# EAGLE design Board_v.02b (EAGLE 6.5.0)
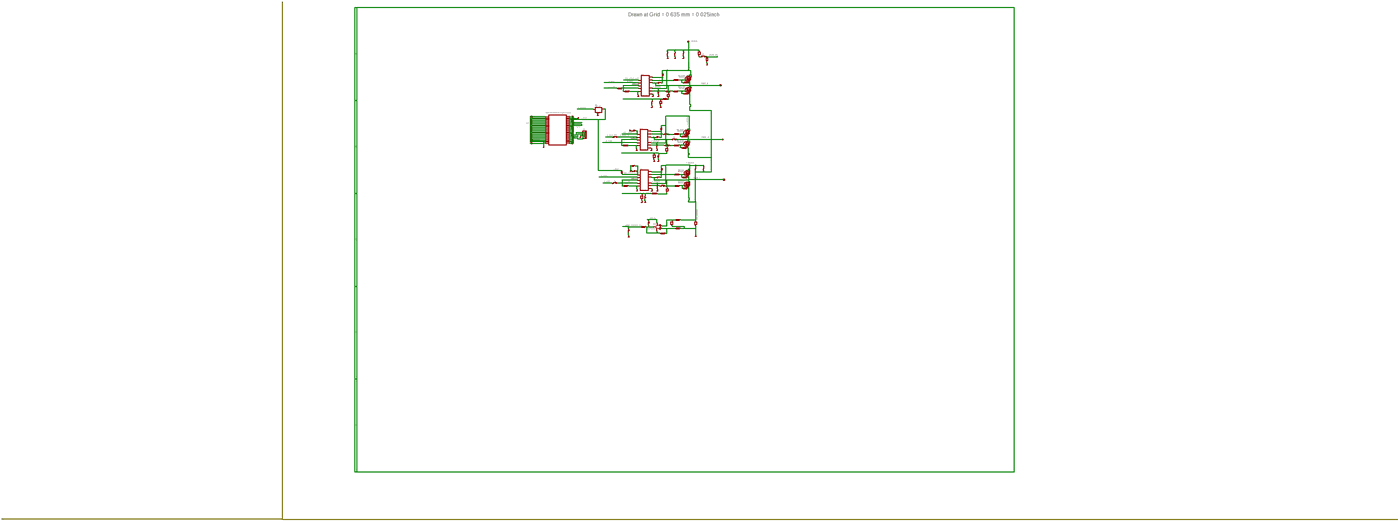
[diagram p0: schematic, sheet 1, overview]
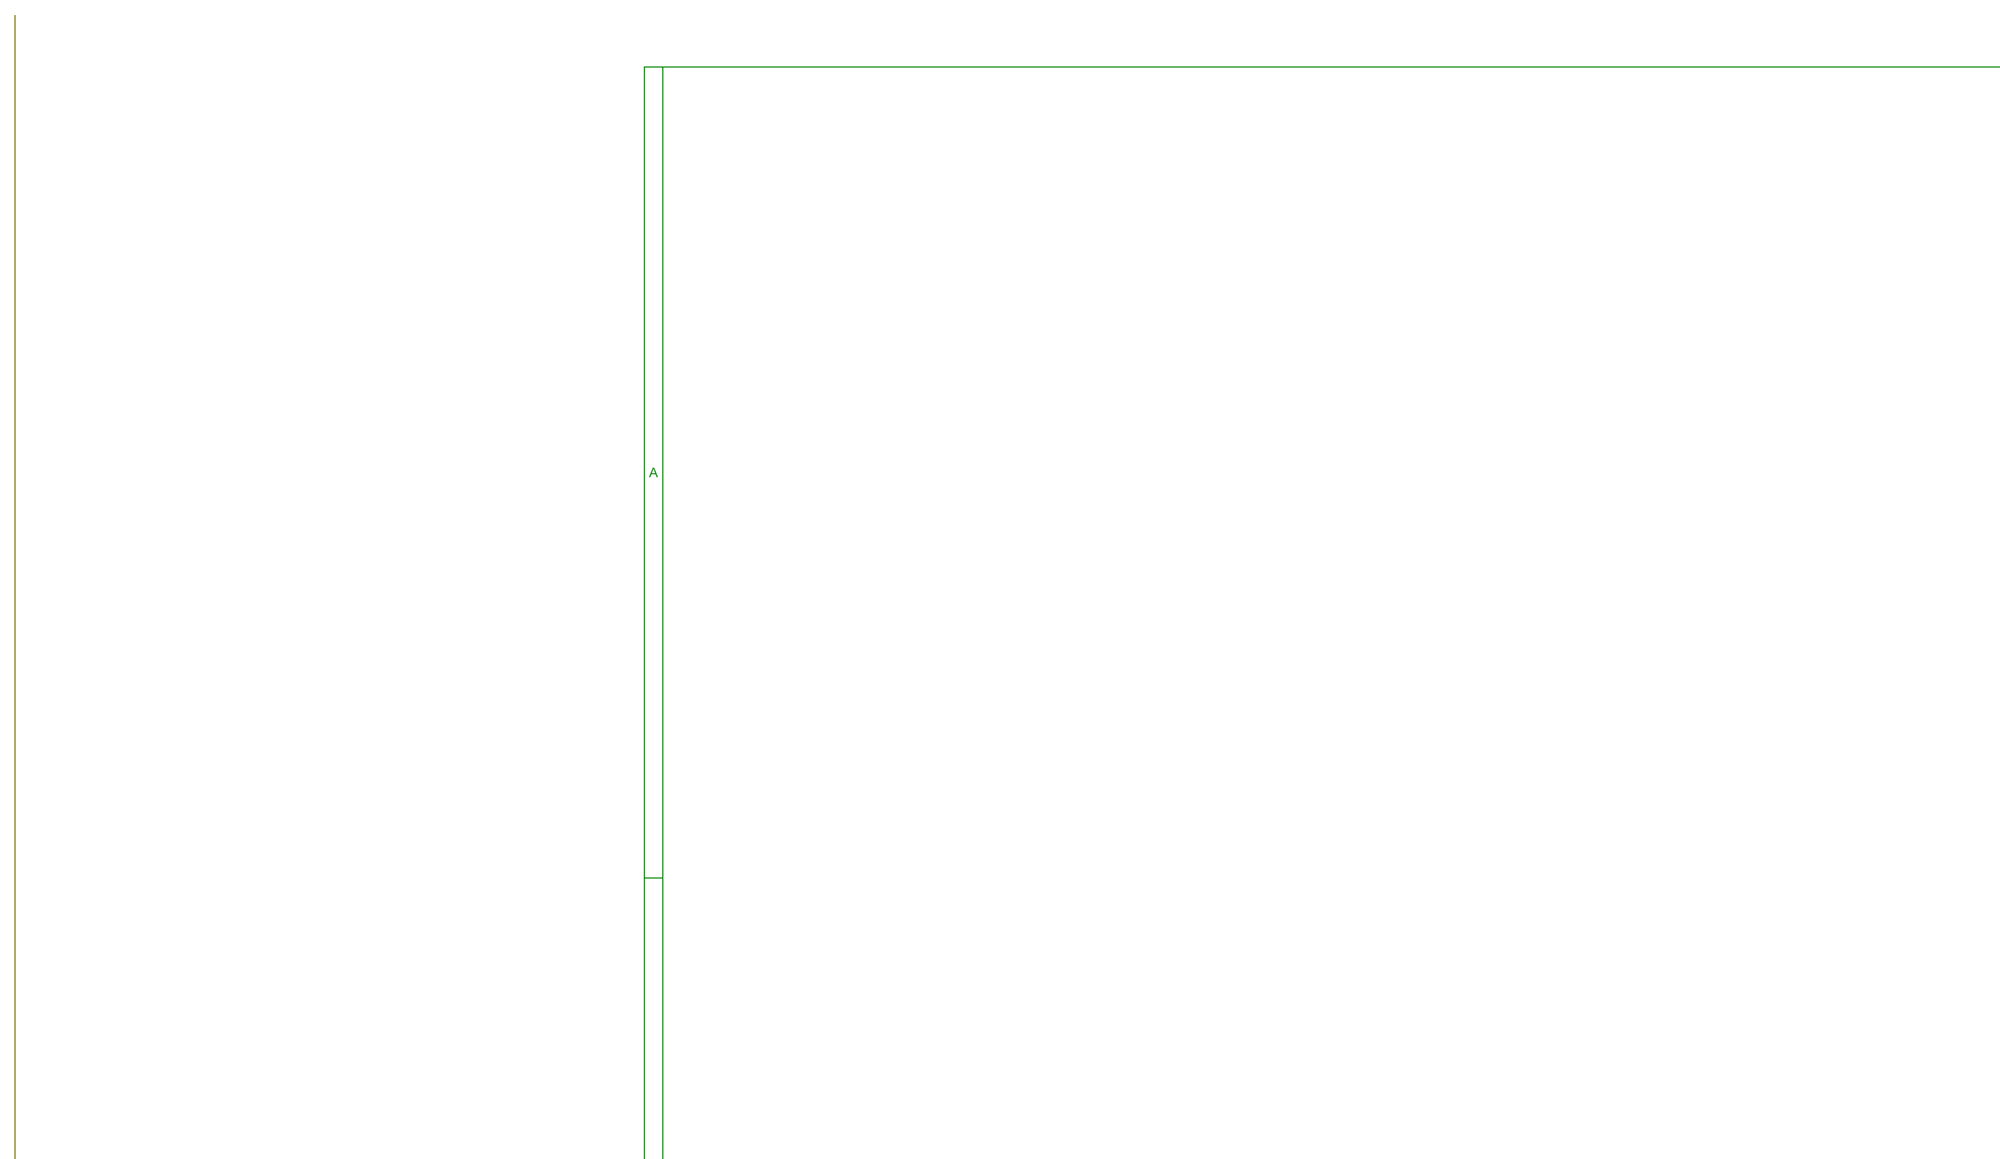
[diagram p1: schematic, sheet 1, part 1 of 7]
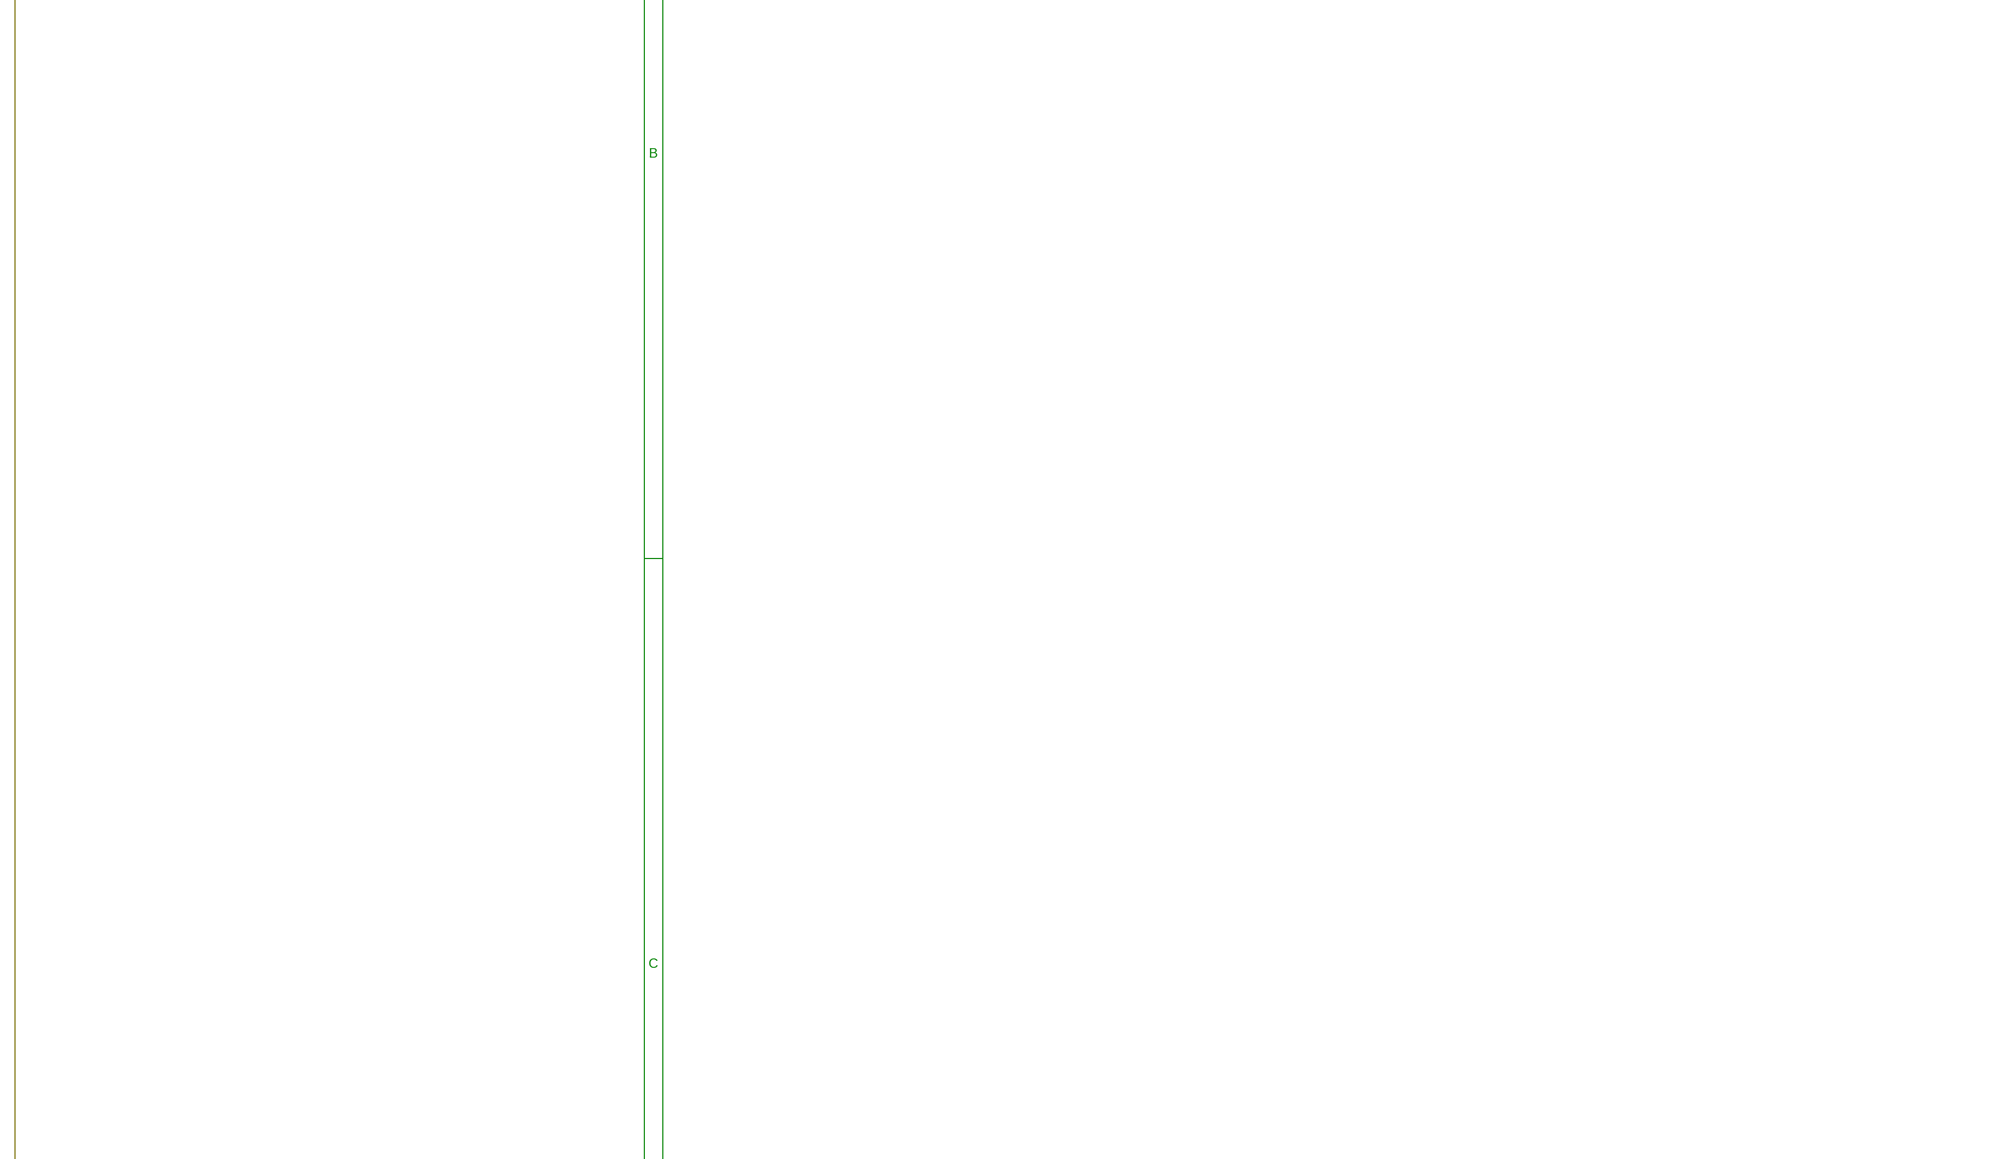
[diagram p2: schematic, sheet 1, part 2 of 7]
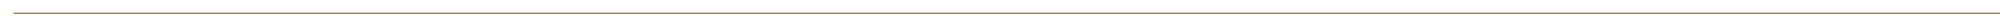
[diagram p3: schematic, sheet 1, part 3 of 7]
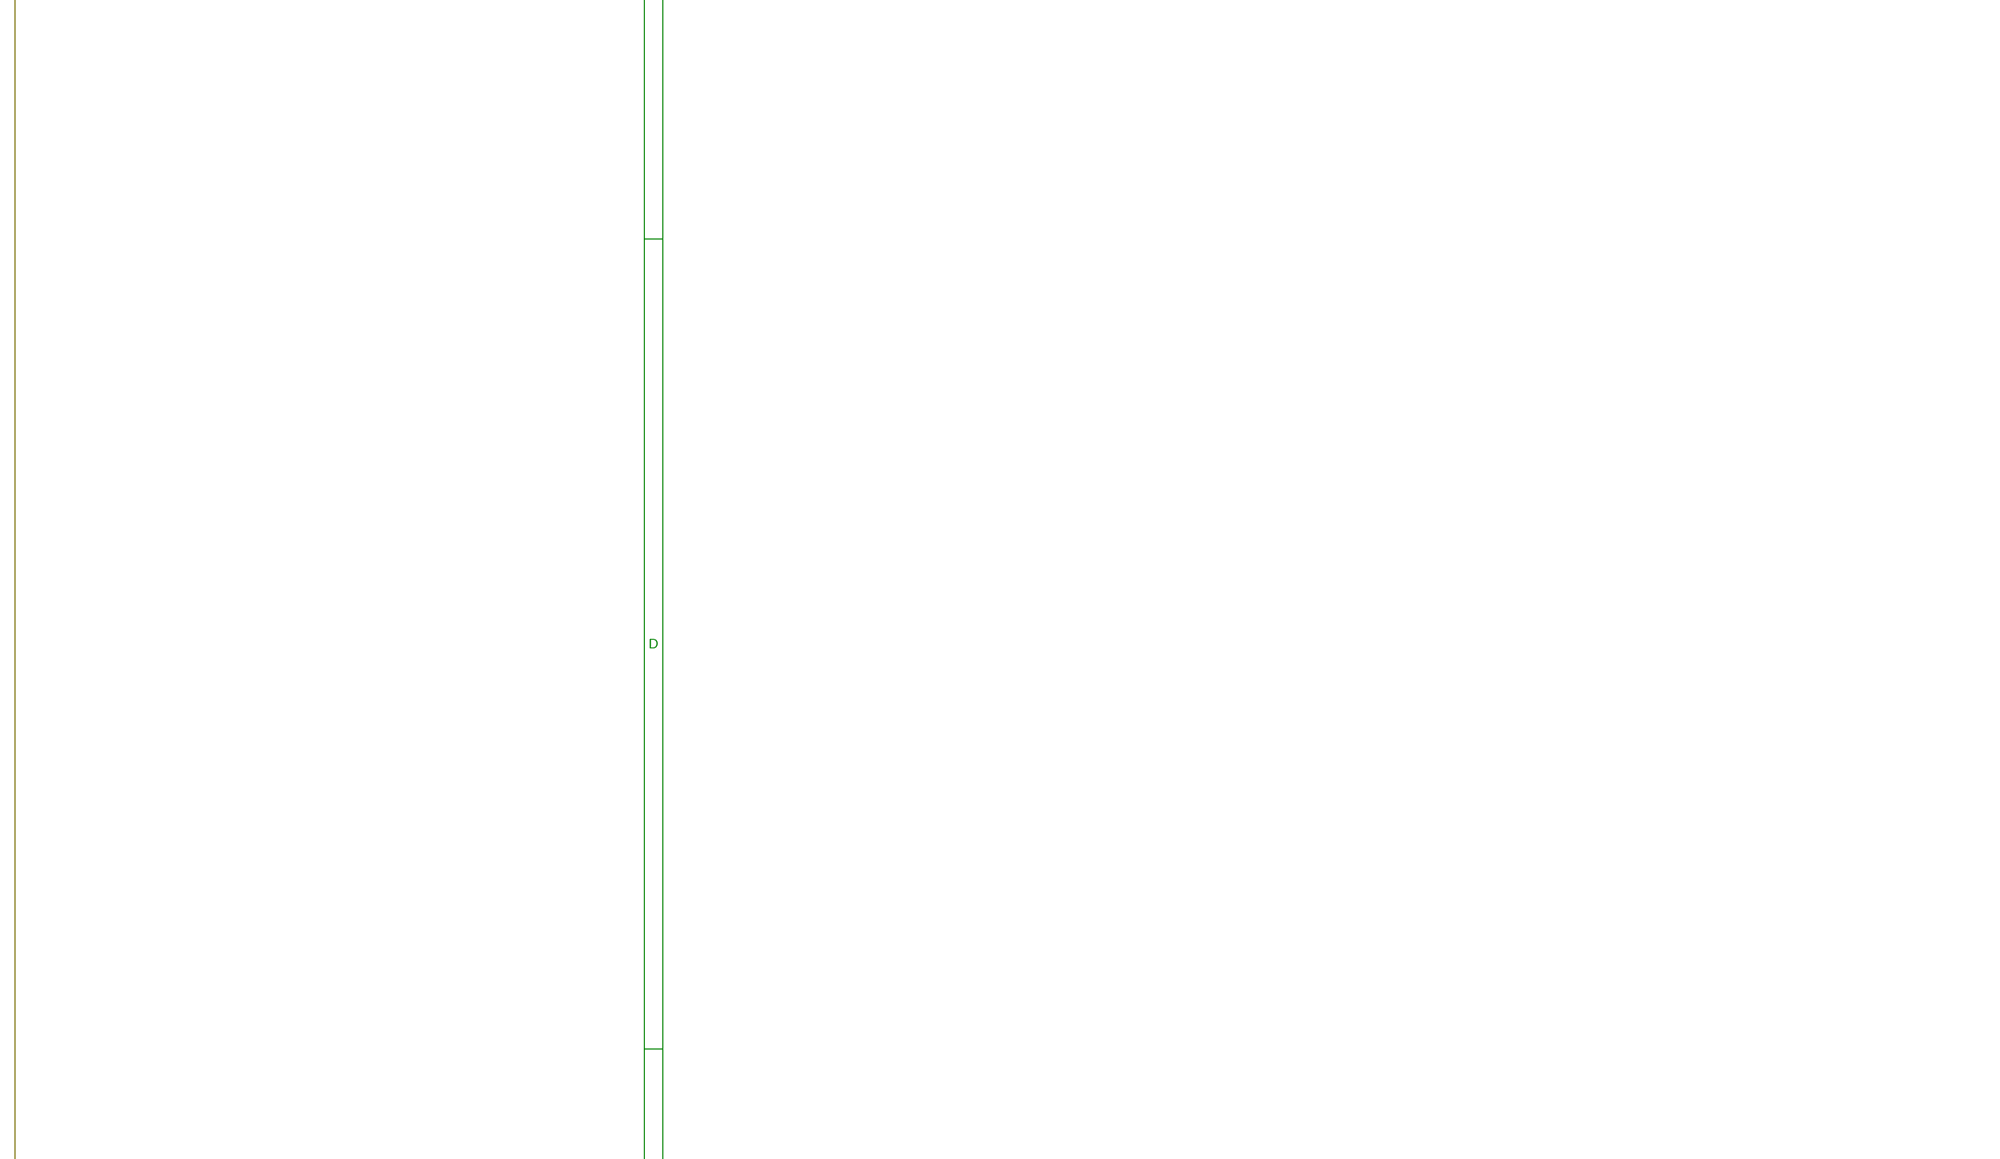
[diagram p4: schematic, sheet 1, part 4 of 7]
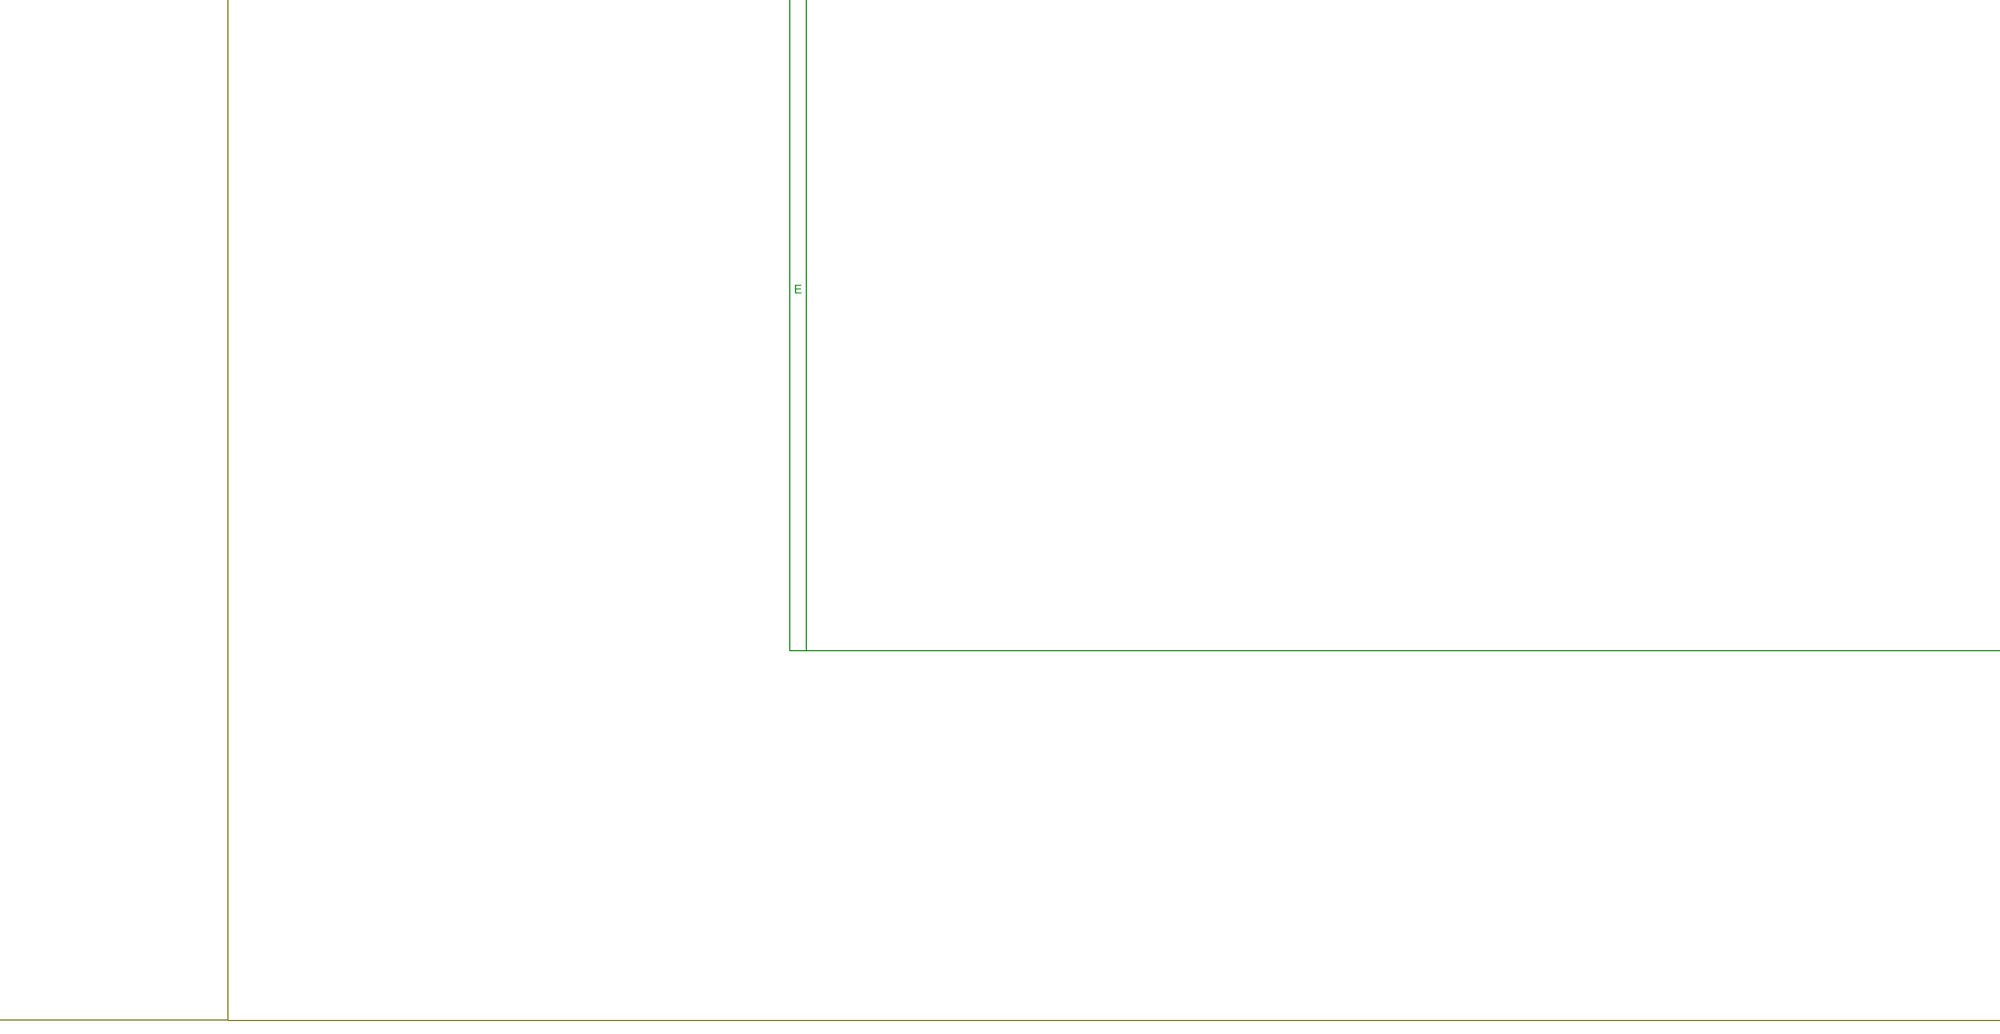
[diagram p5: schematic, sheet 1, part 5 of 7]
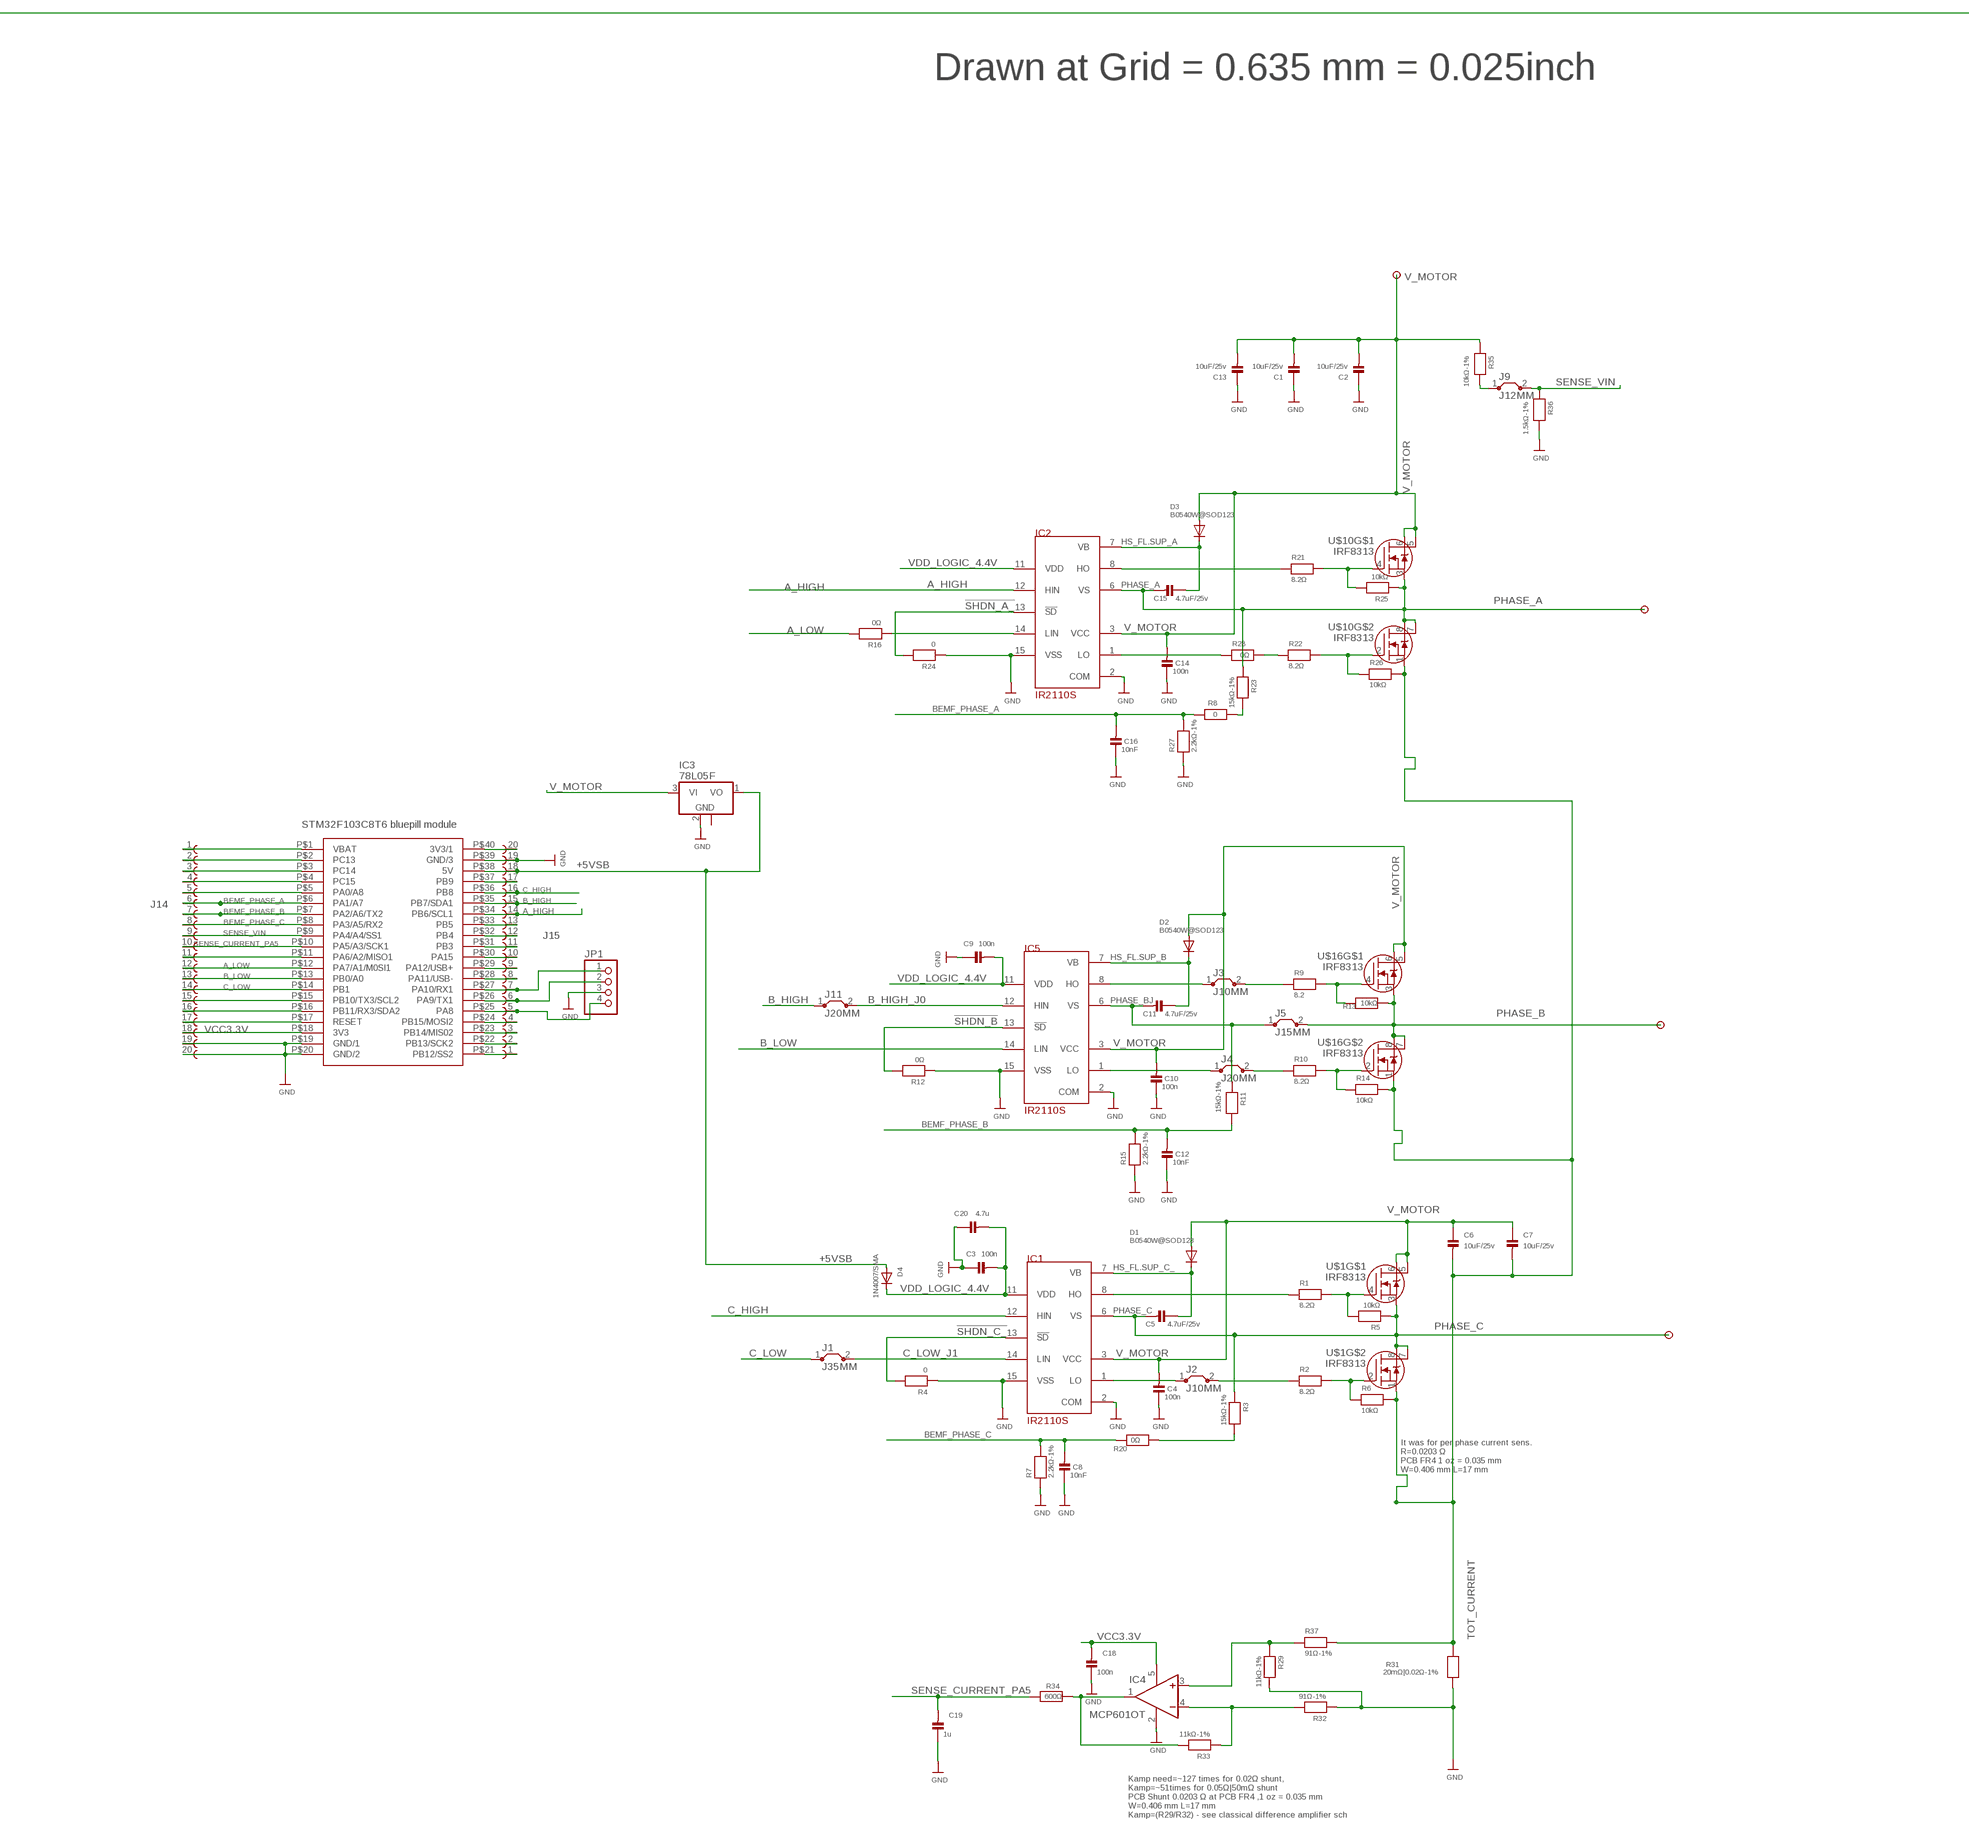
[diagram p6: schematic, sheet 1, part 6 of 7]
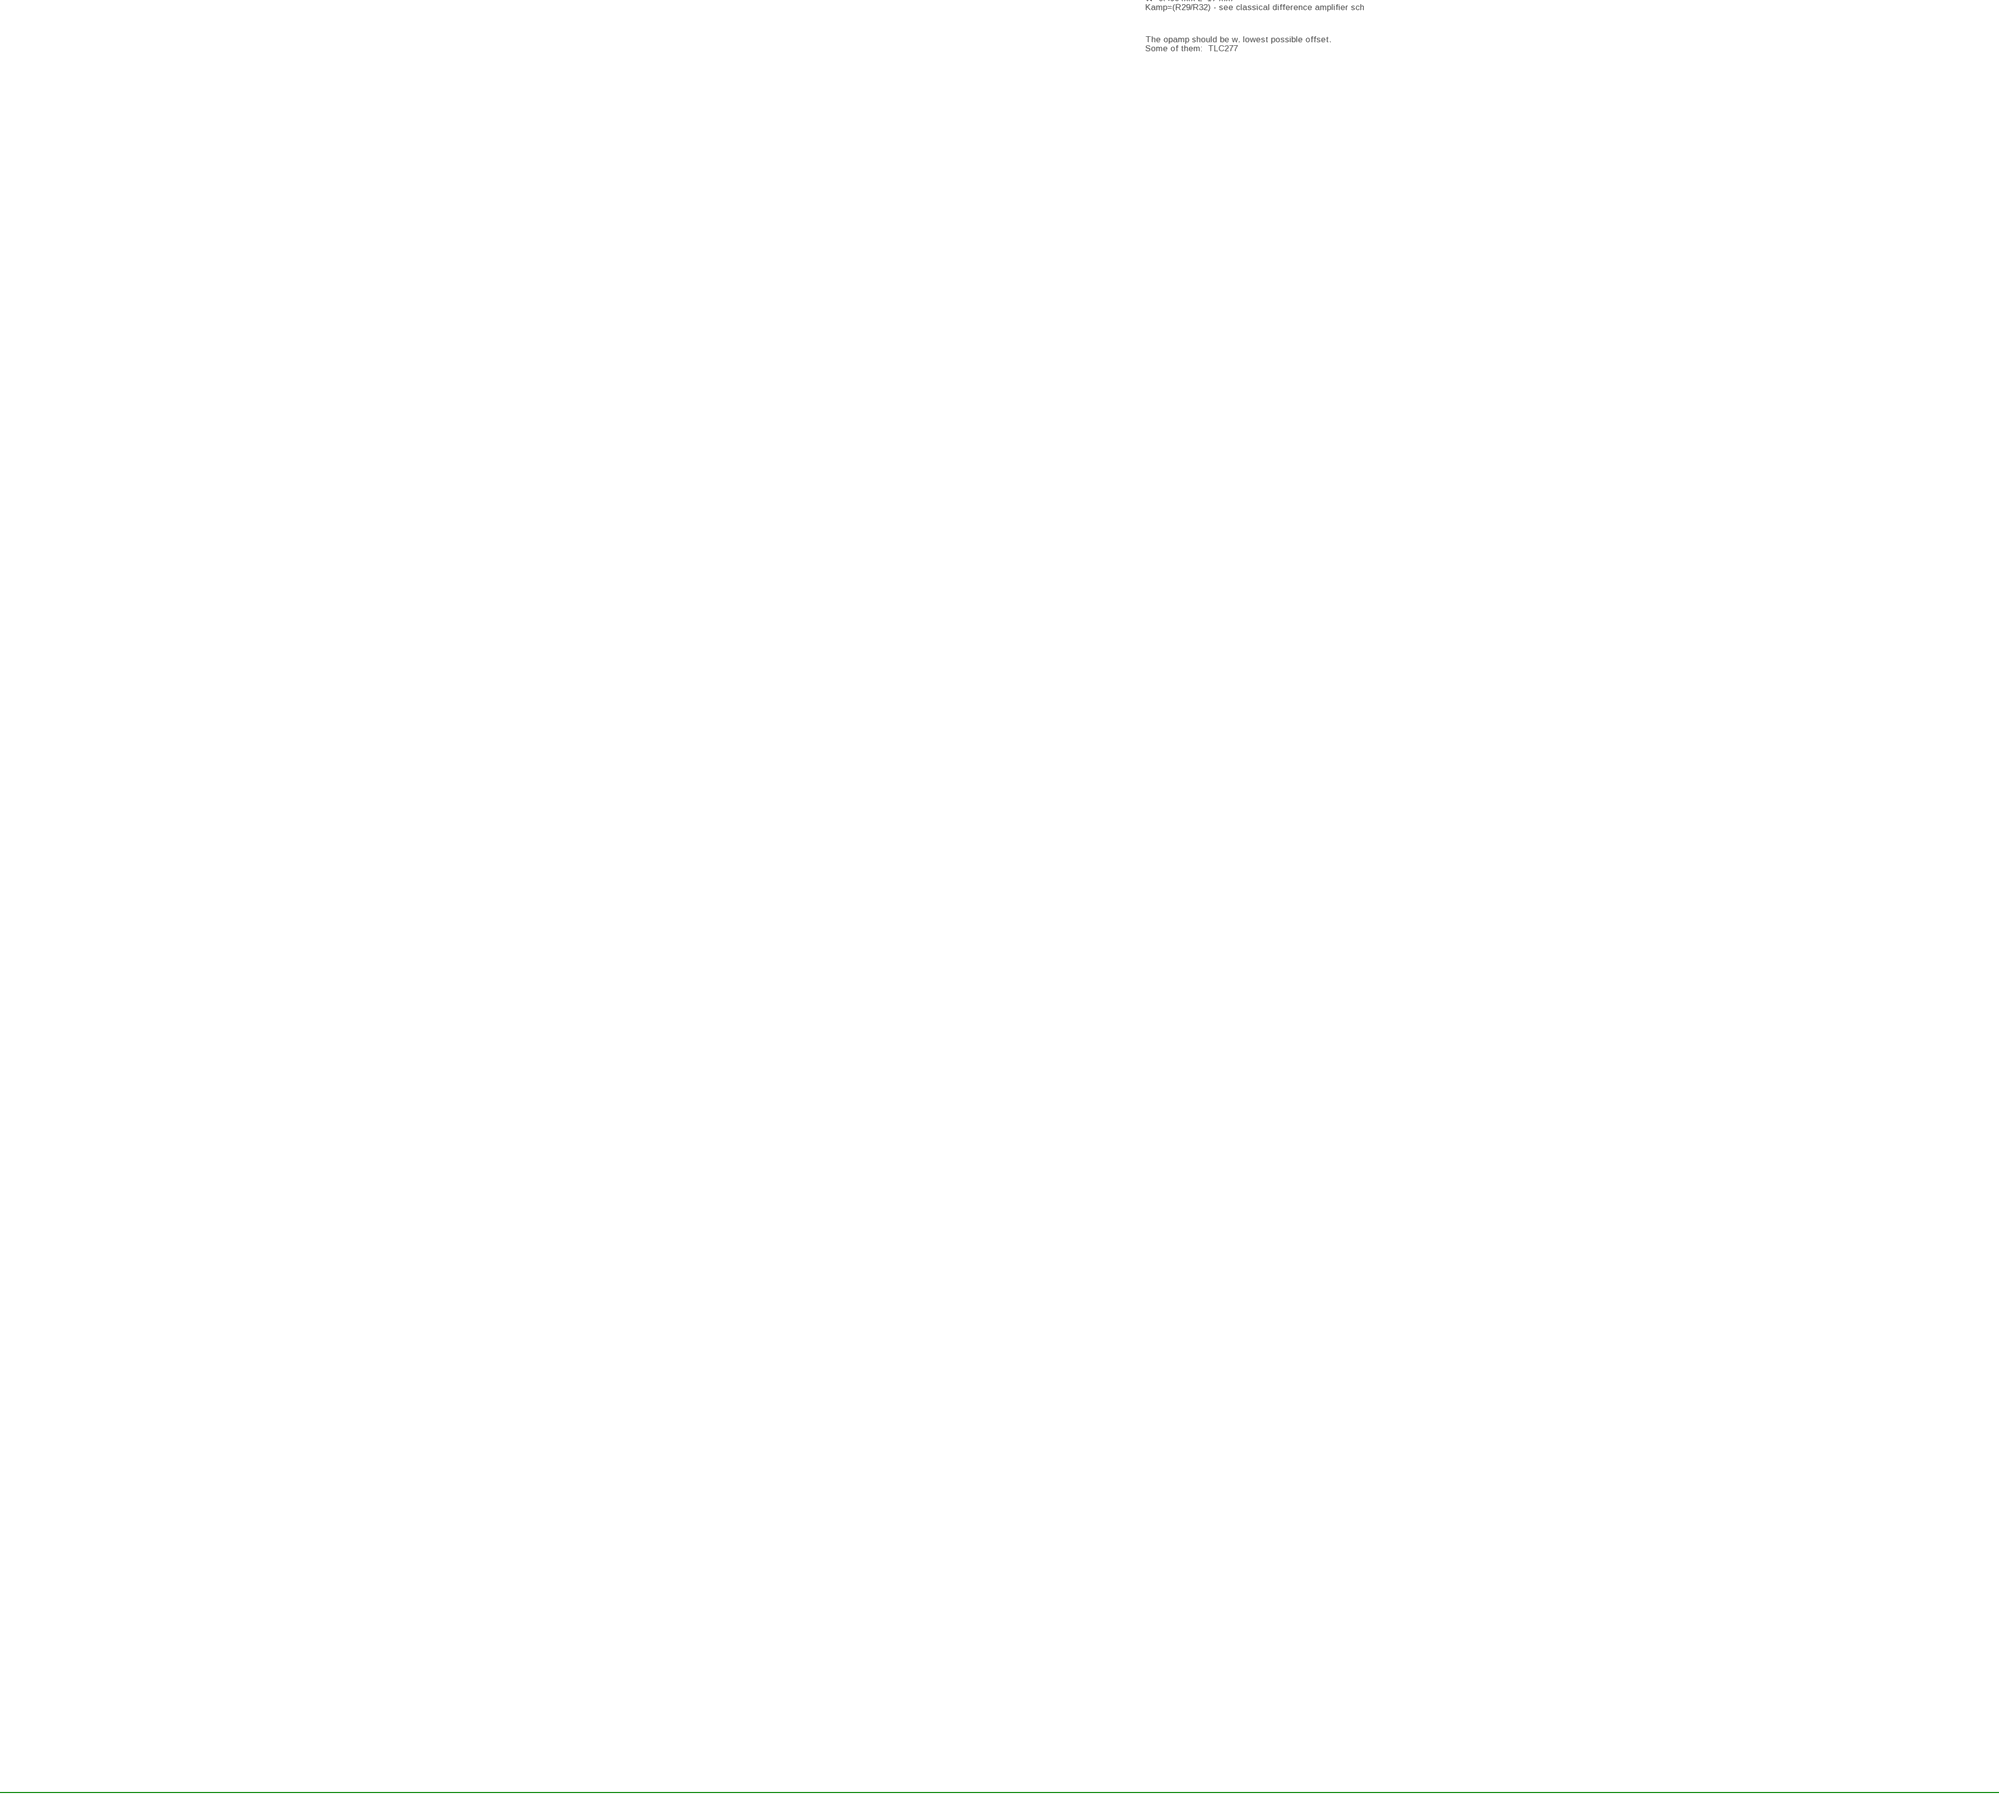
[diagram p7: schematic, sheet 1, part 7 of 7]

## Parts
BLUEPILL-STM32F103C8T6_MODULE  BLUEPILL  [40-DIP-BLUE-PIL]
C1  10uF/25v  CAP_CERAMIC_0805MP  [_0805MP]
C2  10uF/25v  CAP_CERAMIC_0805MP  [_0805MP]
C3  100n  CAP_CERAMIC_0805MP  [_0805MP]
C4  100n  CAP_CERAMIC_0603MP  [_0603MP]
C5  4.7uF/25v  CAP_CERAMIC_0805MP  [_0805MP]
C6  10uF/25v  CAP_CERAMIC_0805MP  [_0805MP]
C7  10uF/25v  CAP_CERAMIC_0805MP  [_0805MP]
C8  10nF  CAP_CERAMIC_0805MP  [_0805MP]
C9  100n  CAP_CERAMIC_0603MP  [_0603MP]
C10  100n  CAP_CERAMIC_0603MP  [_0603MP]
C11  4.7uF/25v  CAP_CERAMIC_0805MP  [_0805MP]
C12  10nF  CAP_CERAMIC_0805MP  [_0805MP]
C13  10uF/25v  CAP_CERAMIC_0805MP  [_0805MP]
C14  100n  CAP_CERAMIC_0603MP  [_0603MP]
C15  4.7uF/25v  CAP_CERAMIC_0805MP  [_0805MP]
C16  10nF  CAP_CERAMIC_0805MP  [_0805MP]
C18  100n  CAP_CERAMIC_0805MP  [_0805MP]
C19  1u  CAP_CERAMIC_0805MP  [_0805MP]
C20  4.7u  CAP_CERAMIC_0805MP  [_0805MP]
D1  B0540W@SOD123  DIODESOD-123  [SOD-123]
D2  B0540W@SOD123  DIODESOD-123  [SOD-123]
D3  B0540W@SOD123  DIODESOD-123  [SOD-123]
D4  1N4007/SMA  DIODESMA  [SMADIODE]
IC1  IR2110S  [SO-16DW]
IC2  IR2110S  [SO-16DW]
IC3  78L05F  [SOT89]
IC4  MCP601OT  [SOT23-5]
IC5  IR2110S  [SO-16DW]
J1  J35MM  [J35MM]
J2  J10MM  [10]
J3  J10MM  [10]
J4  J20MM  [20]
J5  J15MM  [15]
J9  J12MM  [12]
J11  J20MM  [20]
J14  61002013321  [CON-20PIN-SMD-MANUALLY-BENT-FROM-NON-SMD]
J15  61002013321  [CON-20PIN-SMD-MANUALLY-BENT-FROM-NON-SMD]
JP1  PINHD-1X04_2.54-SMD  [1X04SMD]
PHASE_A  PHASE_A  PAD  [PAD]
PHASE_B  PHASE_B  PAD  [PAD]
PHASE_C  PHASE_C  PAD  [PAD]
R1  8.2Ω  RESISTOR_0805MP  [_0805MP]
R2  8.2Ω  RESISTOR_0805MP  [_0805MP]
R3  15kΩ-1%  RESISTOR_0805MP  [_0805MP]
R4  0  RESISTOR_0805MP  [_0805MP]
R5  10kΩ  RESISTOR_0805MP  [_0805MP]
R6  10kΩ  RESISTOR_0805MP  [_0805MP]
R7  2.2kΩ-1%  RESISTOR_0805MP  [_0805MP]
R8  0  RESISTOR_0805MP  [_0805MP]
R9  8.2  RESISTOR_0805MP  [_0805MP]
R10  8.2Ω  RESISTOR_0805MP  [_0805MP]
R11  15kΩ-1%  RESISTOR_0805MP  [_0805MP]
R12  0Ω  RESISTOR_0805MP  [_0805MP]
R13  10kΩ  RESISTOR_0805MP  [_0805MP]
R14  10kΩ  RESISTOR_0805MP  [_0805MP]
R15  2.2kΩ-1%  RESISTOR_0805MP  [_0805MP]
R16  0Ω  RESISTOR_0805MP  [_0805MP]
R20  0Ω  RESISTOR_0805MP  [_0805MP]
R21  8.2Ω  RESISTOR_0805MP  [_0805MP]
R22  8.2Ω  RESISTOR_0805MP  [_0805MP]
R23  15kΩ-1%  RESISTOR_0805MP  [_0805MP]
R24  0  RESISTOR_0805MP  [_0805MP]
R25  10kΩ  RESISTOR_0805MP  [_0805MP]
R26  10kΩ  RESISTOR_0805MP  [_0805MP]
R27  2.2kΩ-1%  RESISTOR_0805MP  [_0805MP]
R28  0Ω  RESISTOR_0805MP  [_0805MP]
R29  11kΩ-1%  RESISTOR_0805MP  [_0805MP]
R31  20mΩ|0.02Ω-1%  RESISTOR2512  [2512]
R32  91Ω-1%  RESISTOR_0805MP  [_0805MP]
R33  11kΩ-1%  RESISTOR_0805MP  [_0805MP]
R34  600Ω  RESISTOR_0805MP  [_0805MP]
R35  10kΩ-1%  RESISTOR_0805MP  [_0805MP]
R36  1.5kΩ-1%  RESISTOR_0805MP  [_0805MP]
R37  91Ω-1%  RESISTOR_0805MP  [_0805MP]
U$1  IRF8313  [SO08]
U$10  IRF8313  [SO08]
U$16  IRF8313  [SO08]
V_MOTOR  V_MOTOR  PAD  [PAD]

## Nets
!SHDN_A_: IC2.13(!SD) R24.2
!SHDN_B: IC5.13(!SD) R12.2
!SHDN_C_: IC1.13(!SD) R4.2
+5VSB: BLUEPILL-STM32F103C8T6_MODULE.P$38(5V) D4.A IC3.1(VO) J15.18
A_HIGH: BLUEPILL-STM32F103C8T6_MODULE.P$34(PB6/SCL1) IC2.12(HIN) J15.14
A_LOW: BLUEPILL-STM32F103C8T6_MODULE.P$12(PA7/A1/M0SI1) J14.12 R16.2
B_HIGH: BLUEPILL-STM32F103C8T6_MODULE.P$35(PB7/SDA1) J11.1 J15.15
B_HIGH_J0: IC5.12(HIN) J11.2
B_LOW: BLUEPILL-STM32F103C8T6_MODULE.P$13(PB0/A0) IC5.14(LIN) J14.13
BEMF_PHASE_A: BLUEPILL-STM32F103C8T6_MODULE.P$6(PA1/A7) C16.2 J14.6 R8.1 R27.2
BEMF_PHASE_B: BLUEPILL-STM32F103C8T6_MODULE.P$7(PA2/A6/TX2) C12.2 J14.7 R11.2 R15.2
BEMF_PHASE_C: BLUEPILL-STM32F103C8T6_MODULE.P$8(PA3/A5/RX2) C8.2 J14.8 R7.2 R20.2
C_HIGH: BLUEPILL-STM32F103C8T6_MODULE.P$36(PB8) IC1.12(HIN) J15.16
C_LOW: BLUEPILL-STM32F103C8T6_MODULE.P$14(PB1) J1.1 J14.14
C_LOW_J1: IC1.14(LIN) J1.2
GND: BLUEPILL-STM32F103C8T6_MODULE.P$19(GND/1) BLUEPILL-STM32F103C8T6_MODULE.P$20(GND/2) BLUEPILL-STM32F103C8T6_MODULE.P$39(GND/3) C1.1 C2.1 C3.1 C4.1 C8.1 C9.1 C10.1 C12.1 C13.1 C14.1 C16.1 C18.1 C19.1 C20.1 IC1.2(COM) IC1.15(VSS) IC2.2(COM) IC2.15(VSS) IC3.2(GND) IC4.2(V-) IC5.2(COM) IC5.15(VSS) J14.19 J14.20 J15.19 JP1.3 R4.1 R7.1 R12.1 R15.1 R24.1 R27.1 R29.2 R31.2 R32.1 R36.2
HS_FL.SUP_A: C15.1 D3.C IC2.7(VB)
HS_FL.SUP_B: C11.1 D2.C IC5.7(VB)
HS_FL.SUP_C_: C5.1 D1.C IC1.7(VB)
N$1: R1.2 R5.2 U$1.4(G)
N$2: J3.2 R9.1
N$3: R2.2 R6.1 U$1.2(G)
N$4: IC1.8(HO) R1.1
N$5: J2.2 R2.1
N$6: IC1.1(LO) J2.1
N$7: R8.2 R23.2
N$8: R3.2 R20.1
N$9: R9.2 R13.2 U$16.4(G)
N$10: IC5.8(HO) J3.1
N$11: R10.2 R14.1 U$16.2(G)
N$12: J4.2 R10.1
N$13: IC5.1(LO) J4.1
N$14: IC4.4(-IN) R32.2 R33.1
N$17: R21.2 R25.2 U$10.4(G)
N$18: R22.2 R26.1 U$10.2(G)
N$19: IC2.8(HO) R21.1
N$20: R22.1 R28.2
N$23: IC2.1(LO) R28.1
N$24: IC4.1(OUT) R33.2 R34.1
N$25: BLUEPILL-STM32F103C8T6_MODULE.P$5(PA0/A8) J14.5
N$26: IC2.14(LIN) R16.1
N$27: J9.1 R35.2
N$30: BLUEPILL-STM32F103C8T6_MODULE.P$26(PA9/TX1) J15.6 JP1.2
N$31: BLUEPILL-STM32F103C8T6_MODULE.P$27(PA10/RX1) J15.7 JP1.1
N$32: IC4.3(+IN) R29.1 R37.1
N$34: BLUEPILL-STM32F103C8T6_MODULE.P$1(VBAT) J14.1
N$35: BLUEPILL-STM32F103C8T6_MODULE.P$2(PC13) J14.2
N$36: BLUEPILL-STM32F103C8T6_MODULE.P$3(PC14) J14.3
N$37: BLUEPILL-STM32F103C8T6_MODULE.P$4(PC15) J14.4
N$38: BLUEPILL-STM32F103C8T6_MODULE.P$11(PA6/A2/MISO1) J14.11
N$39: BLUEPILL-STM32F103C8T6_MODULE.P$15(PB10/TX3/SCL2) J14.15
N$40: BLUEPILL-STM32F103C8T6_MODULE.P$16(PB11/RX3/SDA2) J14.16
N$41: BLUEPILL-STM32F103C8T6_MODULE.P$17(RESET) J14.17
N$43: BLUEPILL-STM32F103C8T6_MODULE.P$21(PB12/SS2) J15.1
N$44: BLUEPILL-STM32F103C8T6_MODULE.P$22(PB13/SCK2) J15.2
N$45: BLUEPILL-STM32F103C8T6_MODULE.P$23(PB14/MIS02) J15.3
N$46: BLUEPILL-STM32F103C8T6_MODULE.P$24(PB15/MOSI2) J15.4
N$47: BLUEPILL-STM32F103C8T6_MODULE.P$25(PA8) J15.5 JP1.4
N$48: BLUEPILL-STM32F103C8T6_MODULE.P$28(PA11/USB-) J15.8
N$49: BLUEPILL-STM32F103C8T6_MODULE.P$29(PA12/USB+) J15.9
N$50: BLUEPILL-STM32F103C8T6_MODULE.P$30(PA15) J15.10
N$51: BLUEPILL-STM32F103C8T6_MODULE.P$31(PB3) J15.11
N$52: BLUEPILL-STM32F103C8T6_MODULE.P$32(PB4) J15.12
N$53: BLUEPILL-STM32F103C8T6_MODULE.P$33(PB5) J15.13
N$54: BLUEPILL-STM32F103C8T6_MODULE.P$37(PB9) J15.17
N$55: BLUEPILL-STM32F103C8T6_MODULE.P$40(3V3/1) J15.20
PHASE_A: C15.2 IC2.6(VS) PHASE_C.1 R23.1 R25.1 U$10.3(S) U$10.7(D) U$10.8(D)
PHASE_B: J5.2 PHASE_B.1 R13.1 U$16.3(S) U$16.7(D) U$16.8(D)
PHASE_BJ: C11.2 IC5.6(VS) J5.1 R11.1
PHASE_C: C5.2 IC1.6(VS) PHASE_A.1 R3.1 R5.1 U$1.3(S) U$1.7(D) U$1.8(D)
SENSE_CURRENT_PA5: BLUEPILL-STM32F103C8T6_MODULE.P$10(PA5/A3/SCK1) C19.2 J14.10 R34.2
SENSE_VIN: BLUEPILL-STM32F103C8T6_MODULE.P$9(PA4/A4/SS1) J9.2 J14.9 R36.1
TOT_CURRENT: C6.2 C7.2 R6.2 R14.2 R26.2 R31.1 R37.2 U$1.1(S) U$10.1(S) U$16.1(S)
V_MOTOR: C1.2 C2.2 C4.2 C6.1 C7.1 C10.2 C13.2 C14.2 D1.A D2.A D3.A IC1.3(VCC) IC2.3(VCC) IC3.3(VI) IC5.3(VCC) R35.1 U$1.5(D) U$1.6(D) U$10.5(D) U$10.6(D) U$16.5(D) U$16.6(D) V_MOTOR.1
VCC3.3V: BLUEPILL-STM32F103C8T6_MODULE.P$18(3V3) C18.2 IC4.5(V+) J14.18
VDD_LOGIC_4.4V: C3.2 C9.2 C20.2 D4.C IC1.11(VDD) IC2.11(VDD) IC5.11(VDD)
Unconnected: IC3.2@1(GND)

## Notes on the sheet
- Drawn at Grid = 0.635 mm = 0.025inch
- It was for per phase current sens.
  R=0.0203 Ω 
  PCB FR4 1 oz = 0.035 mm
  W=0.406 mm L=17 mm
- Kamp need=~127 times for 0.02Ω shunt, 
  Kamp=~51times for 0.05Ω|50mΩ shunt
  PCB Shunt 0.0203 Ω at PCB FR4 ,1 oz = 0.035 mm
  W=0.406 mm L=17 mm
  Kamp=(R29/R32) - see classical difference amplifier sch
- The opamp should be w. lowest possible offset. 
  Some of them:  TLC277

## Library data of the parts
BLUEPILL-STM32F103C8T6_MODULE = maplemini:BLUEPILL; NAME1: STM32F103C8T6 bluepill module
C1-C16 C18-C20 = microbuilder:CAP_CERAMIC: Ceramic Capacitors 0402 - 0402 Surface Mount Capacitors 16pF 50V 5% [Digikey: 445-4899-2-ND] 18pF 50V 5% [Digikey: 490-1281-2-ND] 22pF 50V 5% [Digikey: 490-1283-2-ND] 68pF 50V 5% [Digikey: 490-1289-2-ND] 0.1uF 10V 10% [Digikey: 490-1318-2-ND] 1.0uF 6.3V 10% [Digikey: 490-1320-2-ND] 0603 - 0603 Surface Mount Capacitors 16 pF 50V 5% [Digikey: 445-5051-2-ND] 22 pF 50V [Digikey: PCC220ACVTR-ND] 33 pF 50V 5% [Digikey: 490-1415-1-ND] 56pF 50V 5% [Digikey: 490-1421-1-ND] 220pF 50V 5% [Digikey: 445-1285-1-ND] 680 pF 50V 2200 pF 50V 5% C0G [Digikey: 445-1297-1-ND] 5600 pF 100V 5% X7R [Digikey: 478-3711-1-ND] 0.1 µF 25V 10% [Digikey: PCC2277TR-ND] 0.22 µF 16V 10% X7R [Digikey: 445-1318-1-ND] 1.0 µF 25V 10% [Digikey: 445-5146-2-ND] 0603 - RF Specific 3pF 250V +/-0.1pF RF [Digikey: 712-1347-1-ND] 18 pF 250V 5% [Digikey: 478-3505-1-ND or 712-1322-1-ND] 56 pF 250V 5% C0G RF [Digikey: 490-4867-1-ND] 68 pF 250V RF [Digikey: 490-4868-1-ND] 0805 - 0805 Surface Mount Capacitors 220 pF 250V 2% RF Ceramic Capacitor [Digikey: 712-1398-1-ND] 1000 pF 50V 2% NP0 Ceramic Capacitor [Digikey: 478-3760-1-ND] 0.1 µF 25V 10% Ceramic Capacitor [Digikey: PCC1828TR-ND] 1.0 µF 16V 10% Ceramic Capacitor[Digikey: 490-1691-2-ND] 10.0 µF 10V 10% Ceramic Capacitor[Digikey: 709-1228-1-ND] 10.0 uF 16V 10% Ceramic Capacitor [Digikey: 478-5165-2-ND] 47 uF 6.3V 20% Ceramic Capacitor [Digikey: 587-1779-1-ND or 399-5506-1-ND] 1206 - 1206 Surface Mount Capacitors 47uF 10V 20% Ceramic Capacitor [Digikey: 490-5528-1-ND or 399-5508-1-ND or 445-6010-1-ND] 100uF 6.3V -20%, +80% Y5V Ceramic Capacitor (Digikey: 490-4512-1-ND, Mouser: 81-GRM31CF50J107ZE1L)
D1-D4 = adafruit[some parts from microbuilder.eu]:DIODE: Diode SMADIODE - SMA Surface Mount Package 20V 1A Schottky Diode Digikey: 641-1014-6-ND DO-1N4148 - Through Hole Small Current Diode SOD-123 20V 1 A (.5mV Vf) Schottky Diode - Digikey: MBRX120TPMSCT-ND SOD-323 10V 570mA (.38mV Vf, 3ns) Schottky Diode - Digikey: ZLLS410CT-ND SOD-523 30V 30mA Schottky Diode (RB751S-40TE61) - Digikey: RB751S-40TE61CT-ND SOT23-R/W - SOT23 Package (R = Solder Paste/Reflow Ovens, W = Hand-Soldering) BAT54Film 40V 300mA - Digikey: 497-7162-1-ND
IC1 IC2 IC5 = Gele_v05:IR2110
IC3 = linear:78L*: POSITOIV-VOLTAGE REGULATORS Output up to 100 mA Source: http://focus.ti.com/lit/ds/symlink/ua78l05.pdf
IC4 = linear:MCP601: Single Op Amp 2.7V to 6.0V Single Supply CMOS Source: http://ww1.microchip.com/downloads/en/DeviceDoc/21314g.pdf
J1 = Gele_v04:J: Bridge/ jumper
J2-J5 J9 J11 = jumper:J: Bridge
J14 J15 = Gele_v05:61002013321: 2.54mm SMT Socket Header, 20 Pins, hand-bent from non-smd part=>
JP1 = pinhead-2:PINHD-1X04: PIN HEADER
PHASE_A PHASE_B PHASE_C V_MOTOR = SteveMarple:PAD
R1-R16 R20-R29 R31-R37 = microbuilder:RESISTOR: Resistors 0402 - 0402 Surface Mount Package 22 Ohm 1% 1/16W [Digikey: 311-22.0LRTR-ND] 33 Ohm 5% 1/16W 1.0K 5% 1/16W 1.5K 5% 1/16W 2.0K 1% 1/16W 10.0K 1% 1/16W [Digikey: 311-10.0KLRTR-ND] 10.0K 5% 1/16W [Digikey: RMCF0402JT10K0TR-ND] 12.1K 1% 1/16W [Digikey: 311-22.0LRTR-ND] 100.0K 5% 1/16W 0603 - 0603 Surface Mount Package 0 Ohm 1/10 Watt 1% Resistor 15 Ohm 1/10 Watt 1% Resistor 33 Ohm 1/10 Watt 1% Resistor 49.9 Ohm 1/10 Watt 1% Resistor 100 Ohm 1/10 Watt 1% Resistor 150 Ohm 1/10 Watt 1% Resistor 240 Ohm 1/10 Watt 1% Resistor 390 Ohm 1/10 Watt 1% Resistor 560 Ohm 1/10 Watt 1% Resistor 680 Ohm 1/10 Watt 1% Resistor 750 Ohm 1/10 Watt 1% Resistor 1.0K Ohm 1/10 Watt 1% Resistor 1.5K Ohm 1/10 Watt 1% Resistor 2.0K Ohm 1/10 Watt 1% Resistor 2.2K Ohm 1/10 Watt 1% Resistor 3.3K Ohm 1/10 Watt 1% Resistor 4.7K Ohm 1/10 Watt 1% Resistor 10.0K Ohm 1/10 Watt 1% Resistor 12.0K Ohm 1/10 Watt 1% Resistor 12.1K Ohm 1/10 Watt 1% Resistor 20.0K Ohm 1/10 Watt 1% Resistor 33.0K Ohm 1/10 Watt 1% Resistor 100.0K Ohm 1/10 Watt 1% Resistor 0805 - 0805 Surface Mount Package 0 Ohm 1/8 Watt 1% Resistor 33 Ohm 1/8 Watt 1% Resistor 100 Ohm 1/8 Watt 1% Resistor 150 Ohm 1/8 Watt 1% Resistor 200 Ohm 1/8 Watt 1% Resistor 240 Ohm 1/8 Watt 1% Resistor 330 Ohm 1/8 Watt 1% Resistor 390 Ohm 1/8 Watt 1% Resistor 470 Ohm 1/8 Watt 1% Resistor 1.0K Ohm 1/8 Watt 1% Resistor 1.5K Ohm 1/8 Watt 1% Resistor 2.0K Ohm 1/8 Watt 1% Resistor 4.7K Ohm 1/8 Watt 1% Resistor 5.1K Ohm 1/8 Watt 1% Resistor 5.6K Ohm 1/8 Watt 1% Resistor 10.0K Ohm 1/8 Watt 1% Resistor 22.0K Ohm 1/8 Watt 1% Resistor 33.0K Ohm 1/8 Watt 1% Resistor 100K Ohm 1/8 Watt 1% Resistor 1206 - 1206 Surface Mount Package 2012 - 2010 Surface Mount Package 0.11 Ohm 1/2 Watt 1% Resistor - Digikey: RHM.11UCT-ND
U$1 U$10 U$16 = Misc_HEXFET_Transistors:IRF8313: Dual N-Channel HEXFET® Power MOSFET Applications Load Switch DC/DC Converters Benefits Low Gate Charge and Low RDS(on) Fully Characterized Avalanche Voltage and Current 20V VGS Max. Gate Rating 100% Tested for RG Lead-Free (Qualified to 260°C Reflow) RoHS Compliant (Halogen Free) RDS(ON) 12.5mΩ @VGS = 10V 18.6mΩ @VGS = 4.5V Maximum Ratings VGS = 20V VDS = 30V IDS = 9.7A

## Board
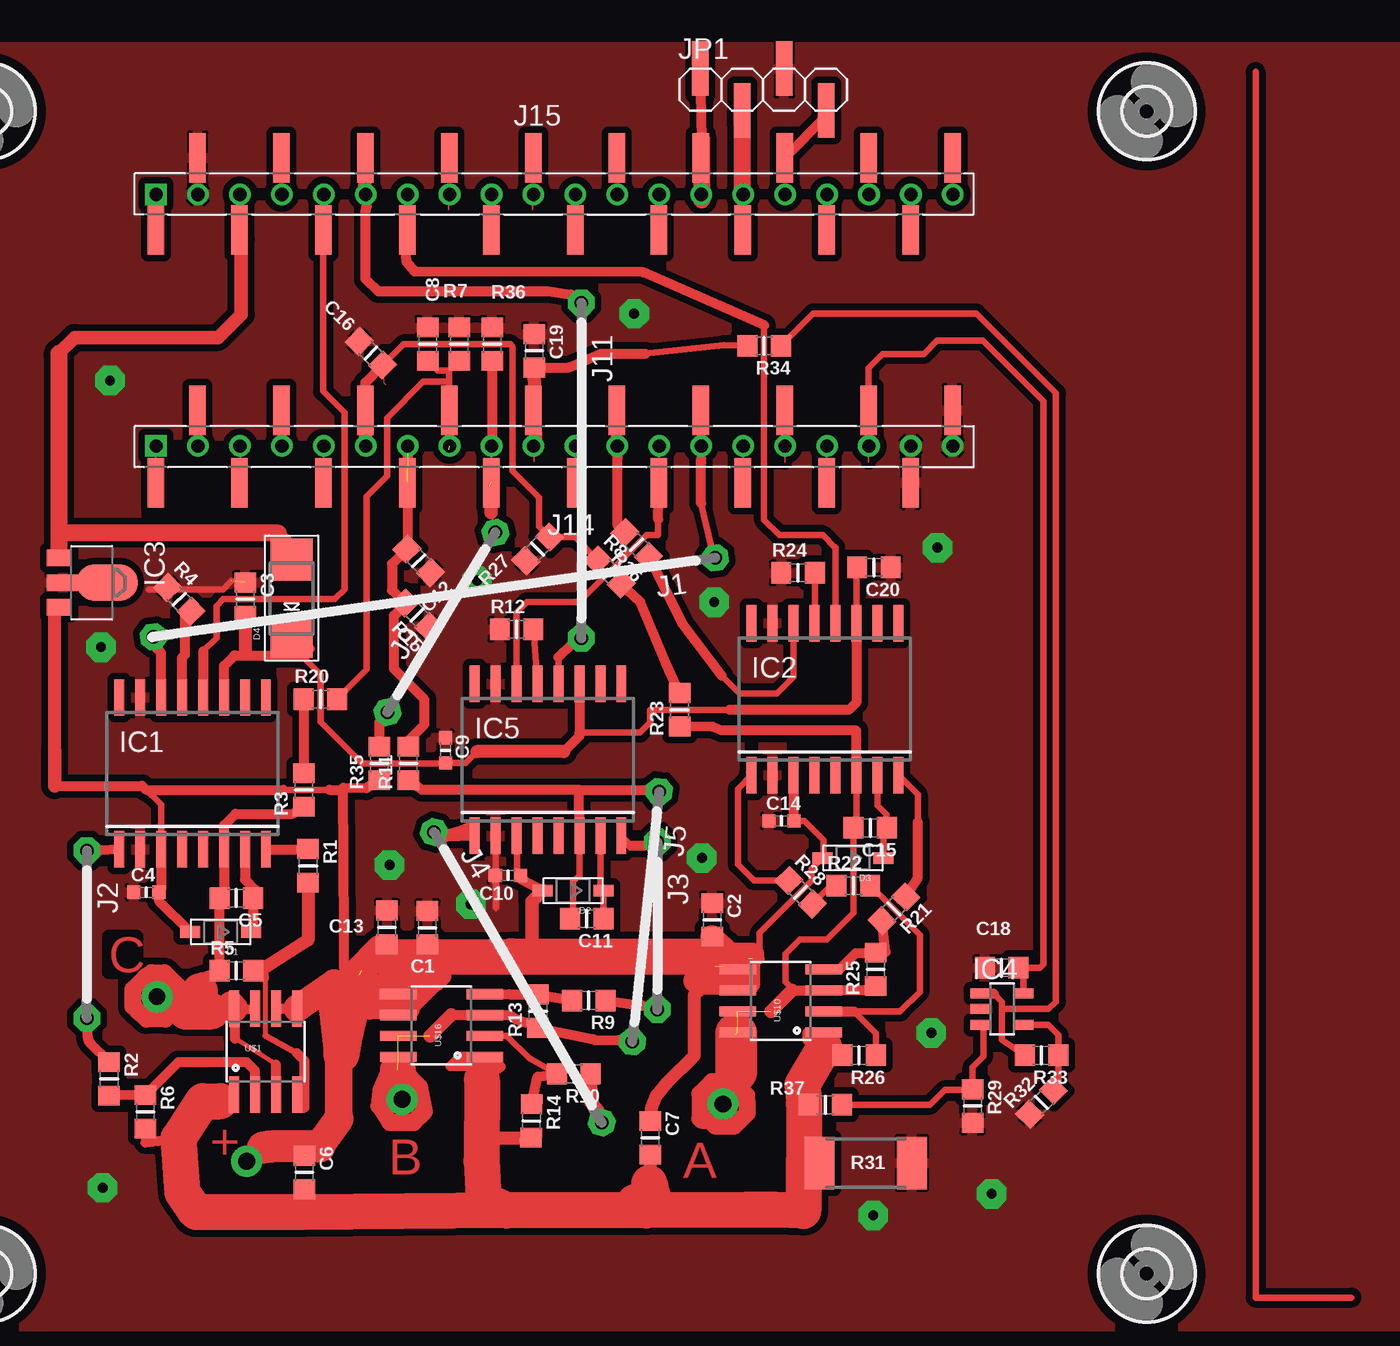
[diagram p8: board, top side]
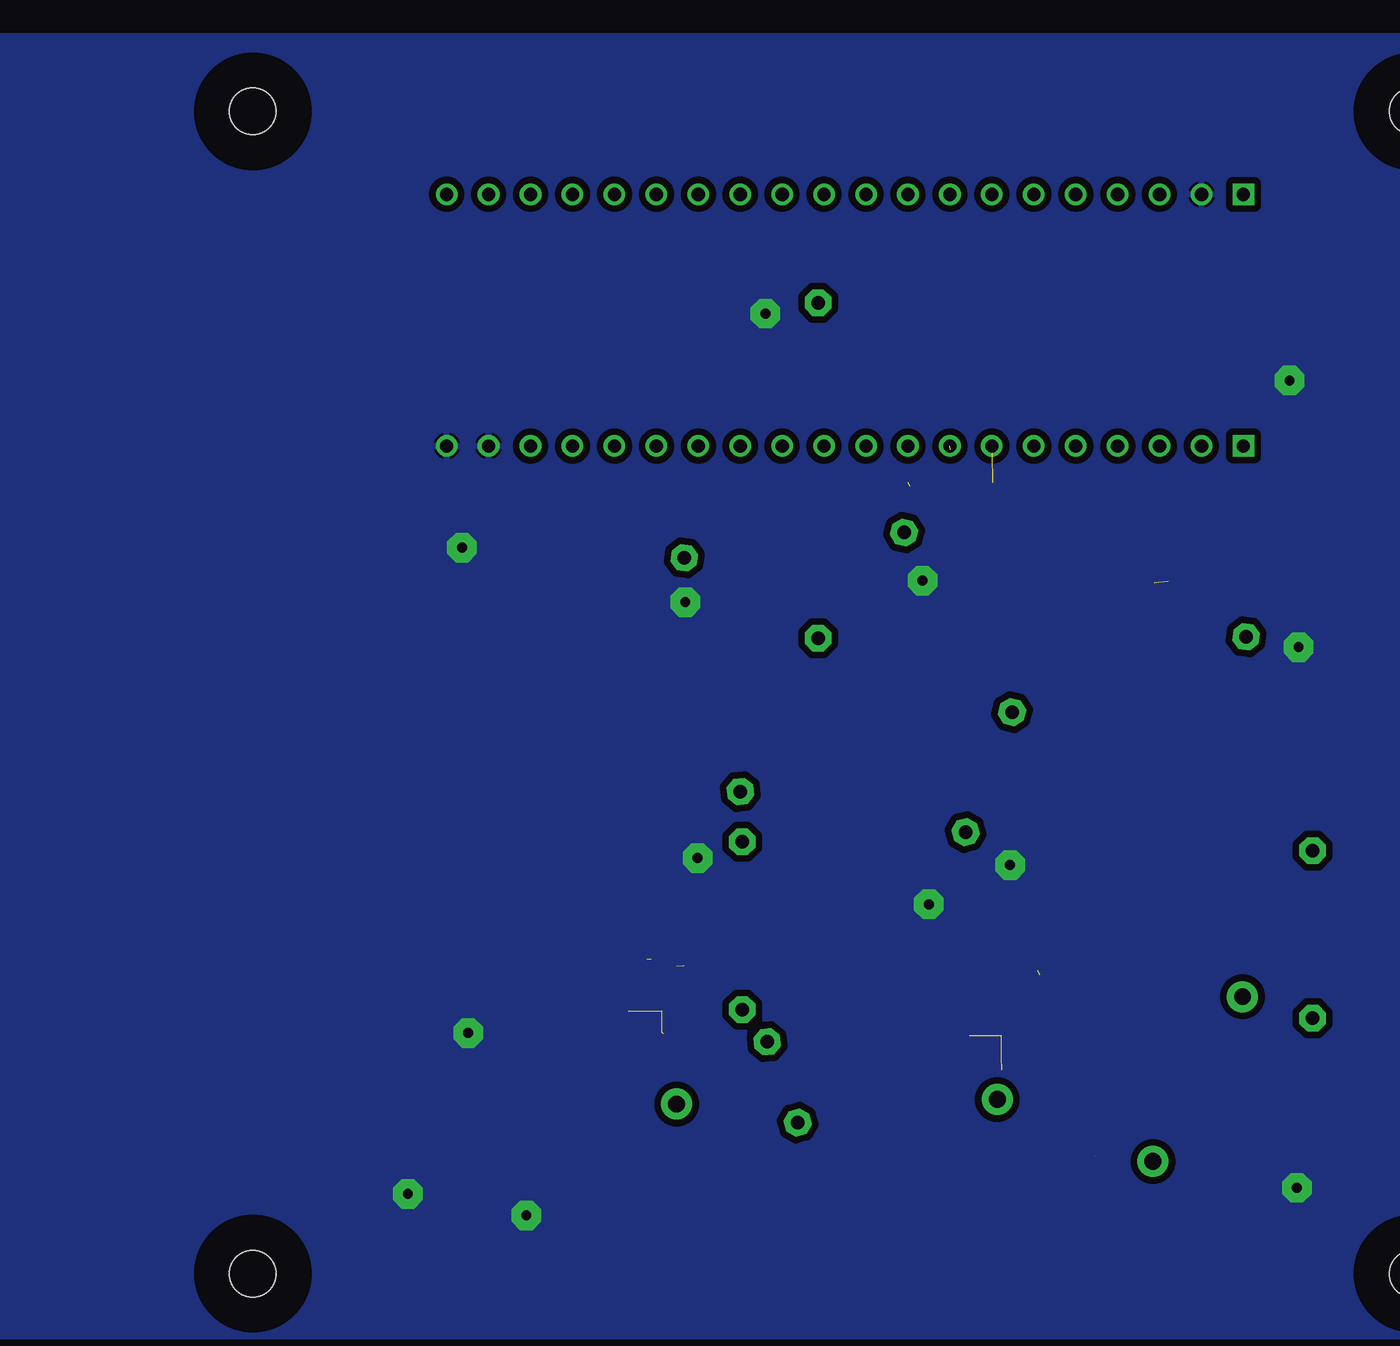
[diagram p9: board, bottom side, seen from below]

No outline drawn. Coordinates in mm, seen from the top.
Copper layers (1*16): Top 0.035mm / dielectric 1.5mm / Bottom 0.035mm
Design rules "default *": minimum track width 0.25mm, minimum drill 24mil, track to track 16mil, track to pad 8mil, pad to pad 8mil, via to via 8mil, smd to smd 8mil, copper to edge 40mil, drill to drill 0.6mm, minimum pad ring 10mil, minimum via ring 8mil, stop-mask expansion 4mil, vias tented up to drill 0mil, thermal gap 6mil

### Footprints (pad centres in the part's own frame; a part is rotated, then mirrored left to right if it is on the bottom)
40-DIP-BLUE-PIL = drill 0.8 square: P$1 -7.62,22.86; P$40 7.62,22.86 | drill 0.8: P$2 -7.62,20.32; P$3 -7.62,17.78; P$4 -7.62,15.24; P$5 -7.62,12.7; P$6 -7.62,10.16; P$7 -7.62,7.62; P$8 -7.62,5.08; P$9 -7.62,2.54; P$10 -7.62,0; P$11 -7.62,-2.54; P$12 -7.62,-5.08; P$13 -7.62,-7.62; P$14 -7.62,-10.16; P$15 -7.62,-12.7; P$16 -7.62,-15.24; P$17 -7.62,-17.78; P$18 -7.62,-20.32; P$19 -7.62,-22.86; P$20 -7.62,-25.4; P$21 7.62,-25.4; P$22 7.62,-22.86; P$23 7.62,-20.32; P$24 7.62,-17.78; P$25 7.62,-15.24; P$26 7.62,-12.7; P$27 7.62,-10.16; P$28 7.62,-7.62; P$29 7.62,-5.08; P$30 7.62,-2.54; P$31 7.62,0; P$32 7.62,2.54; P$33 7.62,5.08; P$34 7.62,7.62; P$35 7.62,10.16; P$36 7.62,12.7; P$37 7.62,15.24; P$38 7.62,17.78; P$39 7.62,20.32
_0805MP = smd 1.2 x 1.3: 1 -1.016,0; 2 1.016,0
_0603MP = smd 0.8 x 0.8: 1 -0.762,0; 2 0.762,0
SOD-123 = smd 1.2 x 0.7: A 1.85,0; C -1.85,0
SMADIODE = smd 2.54 x 2.54: A 2.349,0; C -2.349,0
SO-16DW = smd 0.6 x 2.2: 1 -4.445,-4.6; 2 -3.175,-4.6; 3 -1.905,-4.6; 4 -0.635,-4.6; 5 0.635,-4.6; 6 1.905,-4.6; 7 3.175,-4.6; 8 4.445,-4.6; 9 4.445,4.6; 10 3.175,4.6; 11 1.905,4.6; 12 0.635,4.6; 13 -0.635,4.6; 14 -1.905,4.6; 15 -3.175,4.6; 16 -4.445,4.6
SOT89 = smd 1 x 1.5: 1 -1.499,-1.981; 3 1.499,-1.981 | smd 1 x 2: 2 0,-1.727 | smd 2.2 x 3.7: 2@1 0,0.94
SOT23-5 = smd 0.6 x 1.2: 1 -0.95,-1.306; 2 0,-1.306; 3 0.95,-1.306; 4 0.95,1.306; 5 -0.95,1.306
J35MM = drill 0.813 pad 1.6 octagon: 1 -19.05,0; 2 15.32,0
10 = drill 0.813 pad 1.6 octagon: 1 -5.08,0; 2 5.08,0
20 = drill 0.813 pad 1.6 octagon: 1 -10.16,0; 2 10.16,0
15 = drill 0.813 pad 1.6 octagon: 1 -7.62,0; 2 7.62,0
12 = drill 0.813 pad 1.6 octagon: 1 -6.35,0; 2 6.35,0
CON-20PIN-SMD-MANUALLY-BENT-FROM-NON-SMD = smd 1 x 3: 1 24.13,2.19; 2 21.59,-2.19; 3 19.05,2.19; 4 16.51,-2.19; 5 13.97,2.19; 6 11.43,-2.19; 7 8.89,2.19; 8 6.35,-2.19; 9 3.81,2.19; 10 1.27,-2.19; 11 -1.27,2.19; 12 -3.81,-2.19; 13 -6.35,2.19; 14 -8.89,-2.19; 15 -11.43,2.19; 16 -13.97,-2.19; 17 -16.51,2.19; 18 -19.05,-2.19; 19 -21.59,2.19; 20 -24.13,-2.19
1X04SMD = smd 1.016 x 3.302: 1 -1.27,1.27; 2 1.27,-1.27; 3 3.81,1.27; 4 6.35,-1.27
PAD = drill 1.016 pad 1.88: 1 0,0
2512 = smd 1.8 x 3.2: 1 -2.8,0; 2 2.8,0
SO08 = smd 0.61 x 2.21: 1 -1.905,-2.616; 2 -0.635,-2.616; 3 0.635,-2.616; 4 1.905,-2.616; 5 1.905,2.616; 6 0.635,2.616; 7 -0.635,2.616; 8 -1.905,2.616
MOUNTINGHOLE_2.8 = hole 2.8: 0,0

### Placement (x,y rotation side)
BLUEPILL-STM32F103C8T6_MODULE  37.85,61.55 90 top
C1  31.43,24.75 270 top
C2  48.67,25.23 270 top
C3  20.4,44.65 270 top
C4  14.4,26.9 0 top
C5  19.85,26.55 180 top
C6  23.98,9.93 270 top
C7  44.92,12.03 270 top
C8  31.45,60.1 270 top
C9  32.52,35.5 270 top
C10  36.3,27.93 0 top
C11  41.08,25.3 180 top
C12  30.9,46.98 135 top
C13  28.98,24.77 270 top
C14  52.88,31.23 0 top
C15  58.25,30.8 180 top
C16  28,59.55 315 top
C18  66.2,22.32 0 top
C19  37.9,59.7 270 top
C20  58.48,46.58 180 top
D1  18.9,24.5 180 top
D2  40.25,27 180 top
D3  57.2,28.98 180 top
D4  23.2,44.7 90 top
IC1  17.2,34.1 0 top
IC2  55.5,38.6 0 top
IC3  11.1,45.65 270 top
IC4  66.22,19.82 270 top
IC5  38.73,34.92 0 top
J1  30,44.5 188 top
J2  10.8,24.35 270 top
J3  45.35,24.88 270 top
J4  36.9,21.75 300 top
J5  44.65,25.43 263.9 top
J9  32.27,43.25 59 top
J11  40.75,52.45 270 top
J14  39.1,53.9 180 top
J15  39.1,69.2 0 top
JP1  49.23,75.53 0 top
PHASE_A  15.05,20.57 90 top
PHASE_B  29.9,14.35 270 top
PHASE_C  49.33,14.07 0 top
R1  24.2,28.5 270 top
R2  12.15,15.6 270 top
R3  23.95,33.1 90 top
R4  16.4,44.65 314.3 top
R5  19.85,22.15 0 top
R6  14.35,13.6 270 top
R7  33.35,60.1 270 top
R8  42.45,46.3 315 top
R9  41.2,20.35 180 top
R10  40.3,15.9 180 top
R11  30.27,34.7 90 top
R12  36.83,42.83 0 top
R13  38.12,19.7 90 top
R14  37.73,13.05 268.8 top
R15  30.8,43.7 135 top
R16  44.1,47.95 135 top
R20  24.95,38.6 0 top
R21  59.67,25.9 225 top
R22  57.23,27.3 0 top
R23  46.7,37.95 90 top
R24  53.88,46.25 0 top
R25  58.58,22.23 90 top
R26  57.58,17.02 180 top
R27  38.1,47.7 45 top
R28  54.02,26.9 315 top
R29  64.45,13.95 270 top
R31  57.98,10.5 0 top
R32  68.62,14.18 45 top
R33  68.62,17.02 180 top
R34  51.83,60 180 top
R35  28.52,34.7 90 top
R36  35.35,60.1 90 top
R37  55.52,14.03 180 top
U$1  21.62,17.25 0 top
U$10  52.83,20.32 90 top
U$11  [MOUNTINGHOLE_2.8]  4.75,74.2 0 top
U$12  [MOUNTINGHOLE_2.8]  75,74.2 0 top
U$13  [MOUNTINGHOLE_2.8]  75,3.8 0 top
U$16  32.27,18.82 90 top
U$21  [MOUNTINGHOLE_2.8]  4.75,3.8 0 top
V_MOTOR  20.48,10.6 0 top

### Tracks (layer width: path | path; a pad name or v marks a point on that pad's centre or on a via)
!SHDN_A_
  Top 0.406: IC2.13 54.89,43.2 R24.2
!SHDN_B
  Top 0.406: IC5.13 38.12,39.15 R12.2
!SHDN_C_
  Top 0.61: IC1.13 16.57,41.12 16.75,41.3 16.75,43.56 R4.2
+5VSB
  Top 0.1: BLUEPILL-STM32F103C8T6_MODULE.P$38 20.15,68.09 20.15,67.35 20,67.2 J15.18
  Top 0.61: 20.25,67.25 20.15,67.35
  Top 0.8: D4.A 23.2,47.85 22.4,48.65
  Top 0.813: 9,59.45 9.1,59.55 10.05,60.5 18.75,60.5 20.15,61.9 20.15,66.45 J15.18
  Top 1.016: IC3.1 9.12,48.5 | 9.12,48.5 9.12,59.53 9.1,59.55 | 22.4,48.65 9.27,48.65 9.12,48.5
A_HIGH
  Top 0.1: 30.15,67.45 30.15,68.09 BLUEPILL-STM32F103C8T6_MODULE.P$34
  Top 0.406: 51.83,61.25 51.83,49.45 52.75,48.52 55.38,48.52 56.08,47.83 56.1,47.83 56.13,47.79 IC2.12
  Top 0.6: 51.83,61.25 44.5,64.45 30.65,64.5 | 30.15,65.25 30.15,66.5 J15.14 | 30.15,67.3 30.15,67.45
  Top 0.61: 30.15,65.25 30.15,65.1 30.65,64.5
  Top 0.813: J15.14 30.16,67.24 30.1,67.3 30.15,67.3 30.25,67.2
A_LOW
  Top 0.1: 42.95,53.23 42.95,52.91 BLUEPILL-STM32F103C8T6_MODULE.P$12 42.93,53.42 42.85,53.5
  Top 0.6: 42.85,53.5 42.85,54.48 J14.12
  Top 0.61: 42.95,53.23 42.95,49.1 R16.2
B_HIGH
  Top 0.1: 27.65,69.05 27.65,68.21 BLUEPILL-STM32F103C8T6_MODULE.P$35 27.68,68.11 | J11.1 40.1,63.1
  Top 0.6: 27.75,68.45 27.68,68.11 27.68,64.05 28.45,63.3 38.75,63.3 40.1,63.1
  Top 0.813: J15.15 27.62,69.27 27.6,69.25 27.6,69.1 27.65,69.05
B_HIGH_J0
  Top 0.05: 40.17,41.95 40.41,41.95 J11.2
  Top 0.406: IC5.12 39.36,41.13
  Top 0.61: 39.36,41.13 40.17,41.95
B_LOW
  Top 0.1: 45.45,52 45.45,52.91 BLUEPILL-STM32F103C8T6_MODULE.P$13
  Top 0.406: 45.4,49.5 45.4,48.55 44.7,48.55 40.62,44.48 37.45,44.48 36.82,43.84 IC5.14
  Top 0.61: 45.4,49.5 J14.13 45.45,52
BEMF_PHASE_A
  Top 0.05: C16.2 28.77,57.78 28.9,57.65
  Top 0.1: 27.7,53.6 27.69,53.6 BLUEPILL-STM32F103C8T6_MODULE.P$6
  Top 0.406: 27.69,54.3 27.7,53.6 | 27.67,55.52 J14.6 | C16.2 29.99,60.1 36.45,60.1 36.58,59.92 36.58,52.42 38.2,50.8 38.2,49.04 R27.2 40.36,48.42 R8.1
  Top 0.61: J14.6 27.67,57.78 C16.2
  Top 0.813: J14.6 27.67,54.32 27.69,54.3
BEMF_PHASE_B  (1 unrouted)
  Top 0.1: BLUEPILL-STM32F103C8T6_MODULE.P$7 30.23,53.48 30.25,53.5
  Top 0.61: R11.2 30.27,36.1 31.25,37.08 31.25,38.58 29.4,40.42 29.4,43.67 30.08,44.36 R15.2 30.06,44.42 29.27,45.2 29.27,46.79 C12.2 30.23,47.74 30.23,53.48
BEMF_PHASE_C  (1 unrouted)
  Top 0.406: 32.75,57.83 J14.8 32.75,53.7 | 32.75,57.83 32.75,58.48 | 32.75,58.48 R7.2 | 32.75,58.48 32.05,58.48 C8.2 | R20.2 27.75,40.38 27.75,50.88 28.98,52.1 28.98,55.62 31.18,57.83 32.75,57.83
C_HIGH
  Top 0.1: J15.16 25.13,68.15 BLUEPILL-STM32F103C8T6_MODULE.P$36
  Top 0.406: 25.1,66.53 25.1,57.25 26.4,55.95 26.4,45.25 25.8,44.65 19.05,44.65 18.65,44.25 18.65,42.3 17.85,41.5
  Top 0.61: 25.1,66.53 J15.16 | 17.85,41.5 17.85,38.72 IC1.12
C_LOW
  Top 0.1: 48,52.92 BLUEPILL-STM32F103C8T6_MODULE.P$14 48.01,54.52 J14.14 | 48.6,47.9 48.55,47.88 J1.1
  Top 0.406: 48,50.45 48.6,47.9
  Top 0.61: 48,50.45 48,52.92 48,53.15
C_LOW_J1
  Top 0.1: 15.05,41.65 15,41.79 J1.2
  Top 0.61: IC1.14 15.29,41.41 15.05,41.65
GND  (via drill 0.6 pad 1.78)  (1 unrouted)
  Top 0.406: 19.55,45.75 19.05,45.25 14.55,45.25 | IC5.2 35.58,25.94 C10.1
  other vias: 12.2,57.9 48.05,28.98 34.42,45.77 11.65,41.75 34.05,26.18 58.42,7.33 65.6,8.62 62.33,47.77 48.8,44.48 43.95,61.95 11.75,9 29.12,28.55 61.95,18.38
  pour Bottom: 0,78.74 102.65,78.74 102.65,0 0,0
  pour Top: 102.05,78.1 0.55,78.1 0.5,0.6 102,0.6
HS_FL.SUP_A
  Top 0.406: IC2.7 58.67,32.15 59.23,31.6 59.23,30.84 C15.1 59.05,30.58 D3.C
HS_FL.SUP_B
  Top 0.406: IC5.7 41.9,27.2 D2.C C11.1
HS_FL.SUP_C_
  Top 0.61: IC1.7 20.38,27.68 21,27.05 21,26.68 C5.1 20.87,24.62 D1.C
N$1
  Top 0.305: 21.62,18.2 21.62,21.65
  Top 0.406: 21.62,21.65 21.57,22.5 | 21.62,18.2 23.53,17.14
  Top 0.61: 20.7,21.98 R5.2 21.57,22.5 21.25,22.15 | U$1.4 23.53,14.2 23.88,13.85 23.98,13.85 23.98,16.7 23.53,17.14
  Top 0.8: R1.2 24.2,24 21.25,22.15
N$2
  Top 0.05: 44.48,20.02 45.47,19.75 J3.2
  Top 0.61: R9.1 44.48,20.02
N$3
  Top 0.61: U$1.2 20.99,16.09 20.48,16.6 16.33,16.6 R6.1 | 14.43,14.7 R6.1 | R6.1 14,14.62 R2.2
N$4
  Top 0.61: IC1.8 24.18,29.5 R1.1
N$5
  Top 0.1: 10.85,18.55 arc-45 10.8,18.67 J2.2
  Top 0.61: R2.1 11.04,17.73 arc-45 10.85,18.18 10.85,18.55
N$6
  Top 0.1: 11.5,29.4 10.83,29.4 J2.1
  Top 0.61: IC1.1 11.53,29.43 11.5,29.4
N$7
  Top 0.61: R23.2 45.88,40.75 44.32,44.51 R8.2
N$8
  Top 0.61: R3.2 23.95,38.58 R20.1
N$9
  Top 0.61: U$16.4 35.73,20.73 36.4,20.73 37.78,20.73 R13.2 40.2,20.37 R9.2
N$10
  Top 0.1: 44.55,29.73 45.27,30.02 J3.1
  Top 0.406: IC5.8 43.75,29.73
  Top 0.61: 43.75,29.73 44.55,29.73
N$11
  Top 0.406: U$16.2 36.23,18.19 37.6,16.82 R10.2
  Top 0.61: R14.1 38.11,15.72 R10.2
N$12
  Top 0.1: 41.73,13.7 41.9,13.01 J4.2
  Top 0.813: R10.1 41.34,14.17 41.73,13.7
N$13
  Top 0.05: 32.48,30.45 31.97,30.25 J4.1
  Top 0.406: 33.98,30.88 32.48,30.45
  Top 0.61: IC5.1 32.53,30.25 33.98,30.88
N$14
  Top 0.406: 69.7,16.97 R33.1 | R32.2 69.64,15.19 R33.1 | IC4.4 69.03,18.88 69.65,18.25 69.65,17.03 R33.1
N$17
  Top 0.61: R21.2 59.17,23.27 58.61,23.27 R25.2 58.56,23.23 57.38,23.23 56.38,22.23 U$10.4
N$18
  Top 0.406: R22.2 58.62,26.93 58.65,26.93 61.25,24.32 61.25,20.88 60.05,19.68 57.27,19.68 58.59,18.36 R26.1
  Top 0.61: U$10.2 arc90 55.46,19.68 57.27,19.68
N$19
  Top 0.406: IC2.8 61.12,32.82 61.12,30.9
  Top 0.61: R21.1 61.12,27.77 61.12,30.9 61.12,31.15
N$20
  Top 0.406: R22.1 55.86,27.3 R28.2
N$23
  Top 0.406: R28.1 51.21,27.62 50.23,28.6 50.23,33.17 IC2.1 50.91,34.15
N$24
  Top 0.406: 65.72,20.77 66.22,20.27 66.22,19.77 | 66.22,19.77 66.22,17.97 R33.2 | R34.1 54.79,61.95 64.67,61.95 69.5,57.12 69.5,20.27 69.05,19.82 66.28,19.82 66.22,19.77
  Top 0.6: IC4.1 65.72,20.77
N$25
  Top 0.1: 25.1,53.55 25.15,53.5 BLUEPILL-STM32F103C8T6_MODULE.P$5 25.13,52.91 J14.5
N$26
  Top 0.406: 49.25,40.02 50.33,38.95 52.6,38.95 53.6,39.95 53.6,41.67 53.59,41.68 IC2.14
  Top 0.61: R16.1 46.88,43.15 49.25,40.02
N$27
  Top 0.1: 28.53,37.21 J9.1
  Top 0.61: R35.2 28.53,37.21
N$30
  Top 0.1: 50.5,68.95 50.55,68.9 BLUEPILL-STM32F103C8T6_MODULE.P$26 50.48,68.1 J15.6
  Top 1.016: 50.5,68.95 50.5,72.35 JP1.2
N$31
  Top 0.1: BLUEPILL-STM32F103C8T6_MODULE.P$27 48.01,68.81 48.05,68.85 48.05,69.73 J15.7
  Top 0.61: 48.05,72.49 JP1.1
  Top 1.016: 48.05,68.85 48.05,72.49
N$32
  Top 0.406: 64.92,18.85 IC4.3 65.1,18.69 65.1,16.95 64.45,16.3 R29.1 64.41,14.93 62.77,14.93 61.88,14.03 R37.1
N$33
  Top 0.406: 81.6,76.6 81.6,2.35 87.4,2.35
N$34
  Top 0.1: J14.1 14.97,52.03 14.95,52.05 14.95,52.89 BLUEPILL-STM32F103C8T6_MODULE.P$1
N$35
  Top 0.1: BLUEPILL-STM32F103C8T6_MODULE.P$2 17.53,54.52 J14.2
N$36
  Top 0.1: BLUEPILL-STM32F103C8T6_MODULE.P$3 20.07,51.27 J14.3
N$37
  Top 0.1: BLUEPILL-STM32F103C8T6_MODULE.P$4 22.61,54.52 J14.4
N$38
  Top 0.1: J14.11 40.37,52.91 BLUEPILL-STM32F103C8T6_MODULE.P$11
N$39
  Top 0.1: J14.15 50.53,52.91 BLUEPILL-STM32F103C8T6_MODULE.P$15
N$40
  Top 0.1: J14.16 53.07,52.95 BLUEPILL-STM32F103C8T6_MODULE.P$16
N$41
  Top 0.1: J14.17 55.61,52.91 BLUEPILL-STM32F103C8T6_MODULE.P$17
N$43
  Top 0.1: BLUEPILL-STM32F103C8T6_MODULE.P$21 63.25,69.78 J15.1
N$44
  Top 0.1: J15.2 60.64,68.1 BLUEPILL-STM32F103C8T6_MODULE.P$22
N$45
  Top 0.1: BLUEPILL-STM32F103C8T6_MODULE.P$23 58.17,69.78 J15.3
N$46
  Top 0.1: BLUEPILL-STM32F103C8T6_MODULE.P$24 55.63,66.62 J15.4
N$47
  Top 0.1: BLUEPILL-STM32F103C8T6_MODULE.P$25 53.09,69.78 J15.5
  Top 0.61: J15.5 55.58,73.89 JP1.4
N$48
  Top 0.1: BLUEPILL-STM32F103C8T6_MODULE.P$28 45.47,66.62 J15.8
N$49
  Top 0.1: BLUEPILL-STM32F103C8T6_MODULE.P$29 42.93,69.78 J15.9
N$50
  Top 0.1: BLUEPILL-STM32F103C8T6_MODULE.P$30 40.39,66.62 J15.10
N$51
  Top 0.1: J15.11 37.78,68.24 BLUEPILL-STM32F103C8T6_MODULE.P$31
N$52
  Top 0.1: J15.12 35.24,68.1 BLUEPILL-STM32F103C8T6_MODULE.P$32
N$53
  Top 0.1: J15.13 32.7,68.24 BLUEPILL-STM32F103C8T6_MODULE.P$33
N$54
  Top 0.1: BLUEPILL-STM32F103C8T6_MODULE.P$37 22.61,69.78 J15.17
N$55
  Top 0.1: BLUEPILL-STM32F103C8T6_MODULE.P$40 14.99,66.62 J15.20
PHASE_A  (3 unrouted)
  Top 0.05: 50.23,15.12 49.33,14.22 PHASE_C.1
  Top 0.1: R25.1 58.67,21.11 58.67,20.93
  Top 0.406: IC2.6 57.41,30.97 C15.2 57.23,25.66 55.62,24.05 54,24.05 53.12,23.18 53.12,21.46 53.62,20.96
  Top 0.61: 53.51,20.96 53.62,20.96 U$10.3 55.46,20.98 58.58,20.98 R25.1 | IC2.6 57.41,36.7 49.25,36.7 48.71,36.92 R23.1
  Top 0.813: 52.24,19.69 53.51,20.96
  Top 1.016: 50.12,16.02 49.52,15.43 48.65,15.43 47.92,14.7 47.92,13.2 48.02,13.1 48.5,13.1 48.85,12.75 50.02,12.75 50.8,13.53 50.8,14.2 50.77,14.22 50.77,14.6 50.25,15.12 50.23,15.12
  Top 2.54: 50.12,18.34 50.12,16.02
PHASE_B  (3 unrouted)
  Top 0.1: 30.35,15.72 30.35,15.28 PHASE_B.1 | 43,17.95 arc45 43.75,17.95 J5.2
  Top 0.61: 32.88,19.48 34.88,19.48 U$16.3 36.45,19.46 arc45 37.95,18.98 R13.1 41.39,18.01 arc-45 41.56,17.93 43,17.95
  Top 0.813: 31.59,18.19 32.88,19.48
  Top 1.016: 29.65,16.12 29.15,16.12 28.6,14.88 28.5,13.95 29.15,12.95 30.6,12.95 31.25,13.6 30.95,15.12 30.35,15.72
  Top 2.184: 29.63,16.14 29.65,16.12
PHASE_BJ
  Top 0.05: 44.75,33.1 45.36,33.1 J5.1
  Top 0.406: IC5.6 40.63,27.93 40.25,27.55 40.25,25.49 C11.2
  Top 0.61: R11.1 31.09,33.1 40.6,33.1 | IC5.6 40.66,30.45 40.6,33.1 | 40.6,33.1 44.75,33.1
PHASE_C
  Top 0.254: 19.52,20.07 U$1.7 | PHASE_A.1 16.15,20.57
  Top 0.305: 22.26,16.46 19.77,18.05
  Top 0.61: R3.1 23.27,31.65 19.8,31.65 19.11,30.95 IC1.6 19.11,26.82 C5.2 R5.1 17.74,21.75 16.81,19.68 | U$1.3 22.26,16.46 | 19.77,19.75 U$1.7 | 19.77,18.05 19.77,19.11 U$1.8
  Top 0.813: 18.39,19.7 U$1.8
  Top 1.016: 16.15,20.57 16.15,19.82 15.55,19.23 14.4,19.23 14.05,19.57 14,19.57 13.6,19.98 13.6,21.02 14.35,21.77 14.4,21.77 14.5,21.88 14.55,21.88 14.7,22.02 15.5,22.02 16.2,21.32 16.4,21.07 17.65,20.93
  Top 1.676: U$1.8 19.52,20.07
  Top 2.184: 17.65,20.93 16.81,19.68 18.39,19.7
SENSE_CURRENT_PA5
  Top 0.1: 37.9,53.65 37.9,52.98 BLUEPILL-STM32F103C8T6_MODULE.P$10 | J14.10 37.9,54.48 37.9,54.05 37.9,53.7
  Top 0.406: 44.61,59.52 49.38,60.05 R34.2
  Top 0.6: C19.2 39.98,58.68 41.92,59.52 44.61,59.52
  Top 0.61: 37.9,53.65 37.9,53.7
  Top 0.813: C19.2 37.97,54.05 37.9,54.05
SENSE_VIN  (1 unrouted)
  Top 0.1: 35.2,51.25 35.2,51.5 | 35.25,52.25 BLUEPILL-STM32F103C8T6_MODULE.P$9 35.3,52.94 35.3,53.65 | 35.27,49.9 35.5,48.9 J9.2
  Top 0.61: 35.2,51.5 35.25,52.25 | R36.1 35.35,53.7 35.3,53.65
  Top 0.813: 35.2,51.25 35.25,51.2 35.27,49.9
TOT_CURRENT
  Top 0: 54.08,7.72 55.17,7.72 R31.1 | R37.2 54.22,14.03 54.22,14.08
  Top 0.6: U$16.1 33.37,16.92 32.83,16.38 35.83,16.38 35.88,16.32 34.73,15.55
  Top 0.61: 54.48,17.93 54.42,17.98 54.42,18.38 54.47,18.42 55.59,18.23 | R6.2 14.35,11.75 16.35,12 | 18.88,14.25 19.34,14.25 U$1.1 | C6.2 24,8.5 23.82,7.53 | R26.2 55.7,18.1 | 55.7,18.1 55.59,18.23 | 55.59,18.23 U$10.1 | 55.48,17.52 55.7,18.1
  Top 0.8: C7.2 44.85,9.46 44.17,9.4 44.25,9.07 44.88,9.28 | 54.2,7.6 54.08,7.72
  Top 0.813: R14.2 34.46,12.01 34.7,10.62
  Top 2.184: 44.67,7.62 36.25,7.62 | 36.25,7.62 23.82,7.53 17.43,7.53 16.6,8.72 16.35,12 17.82,14.25 18.88,14.25 | 44.88,9.28 45,8.53 45.08,8.55 | 45.08,8.55 44,8.12 | 55.48,17.52 54.12,15.22 54.23,14.53 54.22,14.08 54.2,7.6 52.44,7.67 50.8,7.67 44.67,7.62 | 44.67,7.62 45.08,8.55 | 34.73,15.55 34.7,10.62 34.83,8.3 36.25,7.62
V_MOTOR  (4 unrouted)
  Top 0.1: 20.9,11.15 V_MOTOR.1 | 24,10.75 C6.1 23.95,11.05 24.88,11.5
  Top 0.406: 22.7,33.1 25.5,33.1 | IC1.3 15.29,32.2 14.3,33.2 | IC5.3 36.84,28.22 C10.2 | C14.2 54.25,31.23 55.4,30.07 55.4,29.02 D3.A 54.7,28.32 54.7,27.57 51.55,24.43 51.55,22.85
  Top 0.61: 47.92,21.02 U$10.6 50.21,21.95 | 8.85,33.35 14.15,33.35 14.3,33.2 14.4,33.1 22.7,33.1 | 25.5,33.1 26.15,33.1 26.32,33.23 | 26.32,33.23 26.4,20.05 26.45,20 26.45,19.96 26.76,19.66 | C1.2 C13.2 28.98,23.08 29.05,23 | 30.5,21.98 30,22.98 | 21.45,11.43 20.5,11.2 20.9,11.15 | IC2.3 53.59,31.44 C14.2 | R35.1 27.72,33.2 26.32,33.23 | IC1.3 15.29,27.03 C4.2 15.16,26.39 D1.A | U$1.6 U$1.5 | C10.2 37.06,27.72 D2.A | 48.3,23.02 48.88,22.45 | U$10.5 50.21,21.95 | 51.55,22.85 51.11,22.85 50.21,21.95 | U$16.6 29.66,19.81 29.68,19.82 | U$16.5 27.62,20.73
  Top 0.8: 8.85,35.48 8.85,43.88 IC3.3 | 47.92,21.02 47.58,20.68 47.58,17 45.95,15.38 45.27,14.57 44.98,13.8 C7.1
  Top 0.813: 8.85,33.35 8.85,35.48 | D2.A 37.75,26.35 37.75,23.03
  Top 1.016: C13.2 28.38,23.76 26.8,22.18 27.45,22.18 28.18,21.45 32.02,21.45 32.38,21.8 32.3,21.8 30.32,19.82 | 27.95,19.82 27.93,19.85 27.46,19.85 27.35,19.96
  Top 1.27: 26.05,16.7 27.15,19.3 27.15,19.4 27.35,19.96 27.62,20.73 | 30.32,19.82 29.68,19.82 27.95,19.82
  Top 1.422: C2.2 49.76,23.12 51.12,23.12 50.88,22.88 50.88,21.38 50.73,21.52 47.62,21.52 48.33,22.23 49.88,22.23 49.7,22.4 49.3,22.4
  Top 1.676: 26.05,16.7 26.05,13.25 | 25.97,17.23 25.66,20.15 | 25.66,20.15 27.33,21.89 | U$1.5 25.78,21.42 25.66,20.15
  Top 1.778: 26.05,13.25 26.05,13.15 24.88,11.5
  Top 1.93: 24.88,11.5 21.98,11.5 21.45,11.43
  Top 2.184: 27.33,21.89 26.9,21.1 26.76,19.66 26.42,18.2 | 26.42,18.2 26.42,18.5 | 28.75,23 29.05,23 30,22.98 36.51,23.03 37.75,23.03 44.35,23.02 48.3,23.02 | 26.33,17.97 26.42,18.2 | 26.22,17.07 26.42,18.2
VCC3.3V
  Top 0.1: J14.18 58.15,52.95 BLUEPILL-STM32F103C8T6_MODULE.P$18
  Top 0.406: IC4.5 67.53,22.01 C18.2 68.53,22.32 68.72,22.52 68.72,56.65 65.08,60.3 62.3,60.3 61.5,59.5 59,59.5 58.15,58.65 J14.18
VDD_LOGIC_4.4V
  Top 0.406: 22.1,41.2 22.1,41.3 | 20.4,41.55 20.4,41.35 20.5,41.25 | 34.42,35.42 33.74,34.74 C9.2 32.49,34.7 27.48,34.7 24.95,37.23 24.95,40.1 23.85,41.2 | 49.73,37.95 44.9,37.95 44.9,37.17 44.3,36.58 40.68,36.58 40.63,36.52 | IC2.11 57.41,46.52 C20.2
  Top 0.61: 22.1,41.2 23.85,41.2 24.3,41.65 D4.C | IC1.11 19.11,40.6 19.75,41.25 20.5,41.25 22.05,41.25 22.1,41.3 | IC5.11 40.63,36.52 40.63,36.35 39.7,35.42 | IC2.11 57.41,38.41 56.95,37.95 49.73,37.95
  Top 0.8: C3.2 20.4,41.55 | 39.7,35.42 34.42,35.42

### Text on the board
Top: C | + | B | A